# EasyEDA Pro project ProPrj_主控驱动一体板_V01_2025-04-22.epro

# Schematic Schematic1
Board Name: Board1; Create Date: 2025-04-20; Page Name: P1; Project Name: 主控驱动一体板_V01; Schematic Name: Schematic1; Update Date: 2025-04-20; Company: 嘉立创EDA; Page Size: A4; Version: V1.0
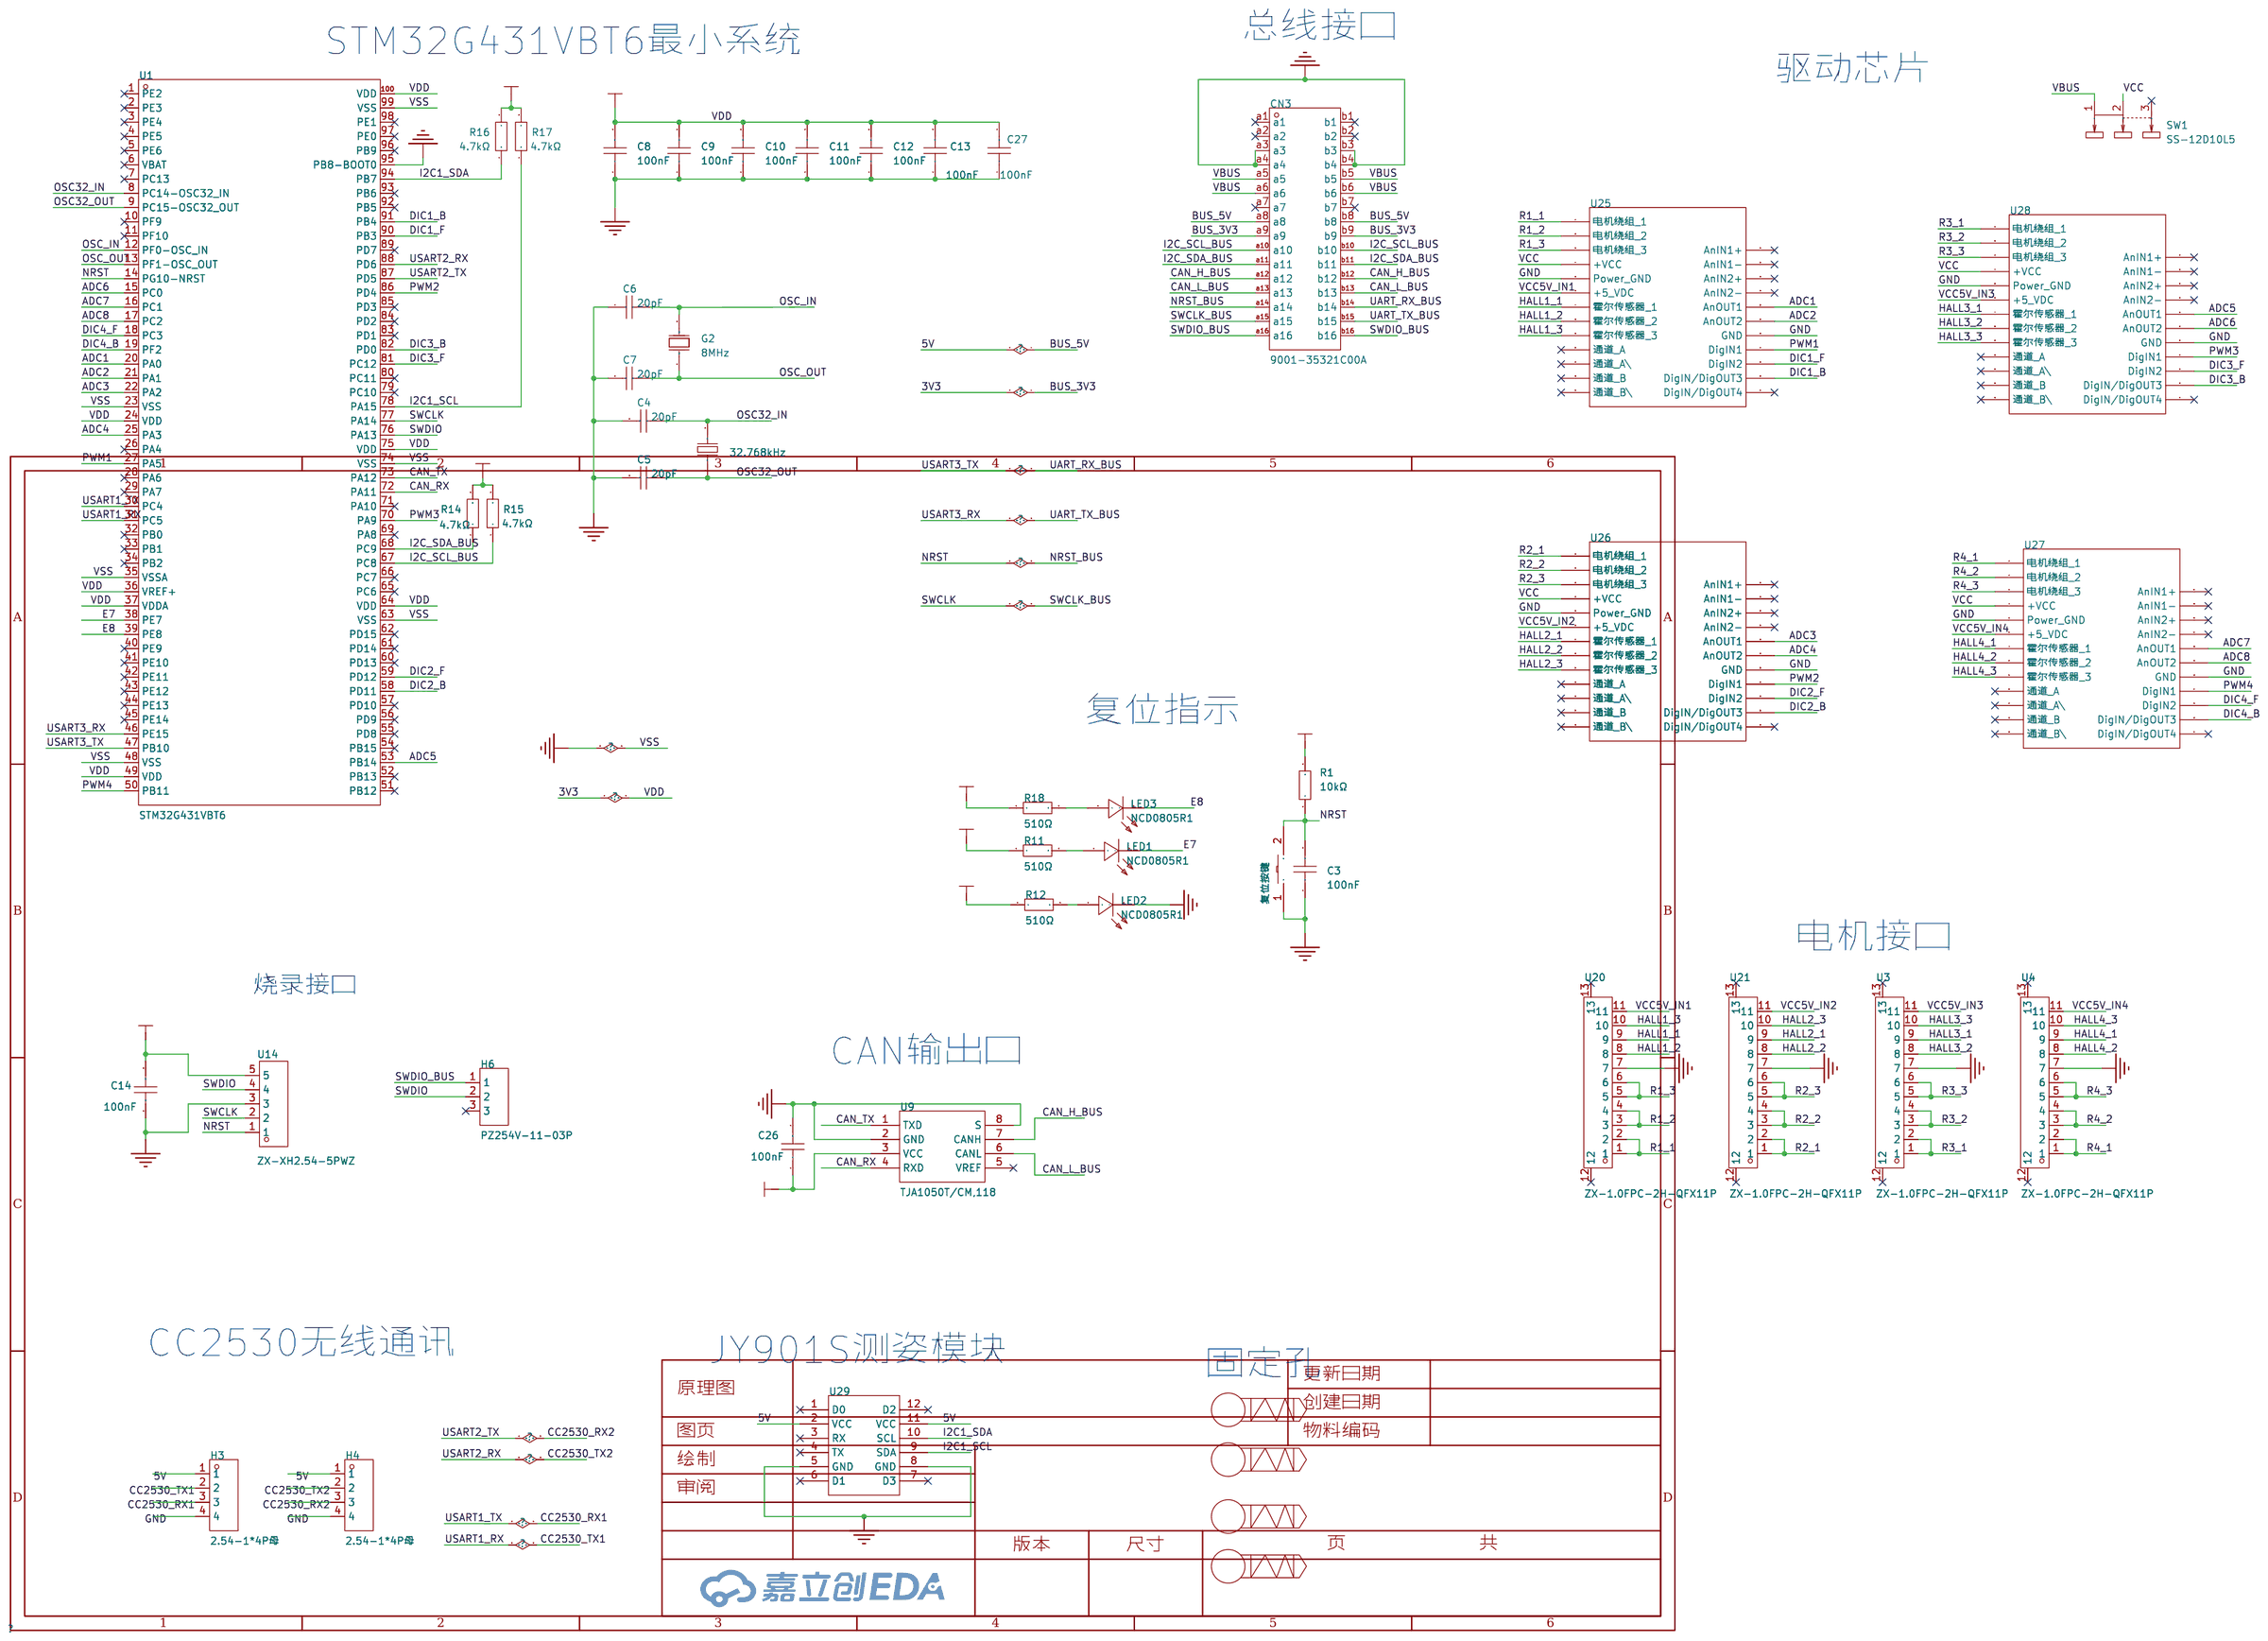
[diagram p0: schematic sheet]

## Parts
C3  100nF  [C0603]
C4  20pF  [C0603]
C5  20pF  [C0603]
C6  20pF  [C0603]
C7  20pF  [C0603]
C8  100nF  [C0603]
C9  100nF  [C0603]
C10  100nF  [C0603]
C11  100nF  [C0603]
C12  100nF  [C0603]
C13  100nF  [C0603]
C14  100nF  [C0603]
C26  100nF  [C0603]
C27  100nF  [C0603]
CN3  9001-35321C00A  [CONN-TH_32P-P2.54_9001-35321C00A]
G1  32.768kHz  [FC-135R_L3.2-W1.5]
G2  8MHz  [CRYSTAL-SMD_L5.0-W3.2]
H3  2.54-1*4P母  [DL-20]
H4  2.54-1*4P母  [DL-20]
H6  PZ254V-11-03P  [HDR-TH_3P-P2.54-V-M]
KEY1  复位按键  [SW-SMD_L6.0-W3.3-LS8.0]
LED1  NCD0805R1  [LED0805-R-RD]
LED2  NCD0805R1  [LED0805-R-RD]
LED3  NCD0805R1  [LED0805-R-RD]
R1  10kΩ  [R0603]
R11  510Ω  [R0603]
R12  510Ω  [R0603]
R14  4.7kΩ  [R0603]
R15  4.7kΩ  [R0603]
R16  4.7kΩ  [R0603]
R17  4.7kΩ  [R0603]
R18  510Ω  [R0603]
SW1  SS-12D10L5  [SW-TH_SS-12D10L5]
TP1  M3铜柱带丝印  [footprint_c5c0]
TP2  M3铜柱带丝印  [footprint_c5c0]
TP3  M3铜柱带丝印  [footprint_c5c0]
TP4  M3铜柱带丝印  [footprint_c5c0]
U1  STM32G431VBT6  [LQFP-100_L14.0-W14.0-P0.50-LS16.0-BL]
U3  ZX-1.0FPC-2H-QFX11P  [FPC-SMD_11P-P1.00_ZX-1.0FPC-2H-QFX11P]
U4  ZX-1.0FPC-2H-QFX11P  [FPC-SMD_11P-P1.00_ZX-1.0FPC-2H-QFX11P]
U9  TJA1050T/CM,118  [SOIC-8_L5.0-W4.0-P1.27-LS6.0-BL]
U14  ZX-XH2.54-5PWZ  [CONN-TH_ZX-XH2.54-5PWZ]
U20  ZX-1.0FPC-2H-QFX11P  [FPC-SMD_11P-P1.00_ZX-1.0FPC-2H-QFX11P]
U21  ZX-1.0FPC-2H-QFX11P  [FPC-SMD_11P-P1.00_ZX-1.0FPC-2H-QFX11P]
U25  -  [MAXON_2]
U26  -  [MAXON_2]
U27  -  [MAXON_2]
U28  -  [MAXON_2]
U29  -  [JY901S_无评估板]

## Library data of the parts
C3 C8-C14 C26 C27 = CC0603KRX7R9BB104: 容值:100nF;精度:±10%;额定电压:50V;材质(温度系数):X7R;; LCSC Part Name: 100nF ±10% 50V; Supplier Part: C14663; Manufacturer: YAGEO(国巨); Supplier Footprint: 0603; JLCPCB Part Class: 基础库; Datasheet: https://atta.szlcsc.com/upload/public/pdf/source/20180910/C282072_33301C7F631E79921B82A8DAC6BCC5B3.pdf; Supplier: LCSC; Tolerance: ±10%; Voltage Rated: 50V; Temperature Coefficient: X7R
C4-C7 = CL10C200JB8NNNC: 容值:20pF;精度:±5%;额定电压:50V;材质(温度系数):C0G;; LCSC Part Name: 20pF ±5% 50V; Supplier Part: C1648; Manufacturer: SAMSUNG(三星); Supplier Footprint: 0603; JLCPCB Part Class: Basic Part; Datasheet: https://atta.szlcsc.com/upload/public/pdf/source/20160218/1457707763339.pdf; Supplier: LCSC; Tolerance: ±5%; Voltage Rated: 50V; Temperature Coefficient: C0G
CN3 = 9001-35321C00A: Supplier Part: C5173389; Manufacturer: WingTAT(格林柏); Supplier Footprint: 弯插,P=2.54mm; JLCPCB Part Class: 扩展库; Datasheet: https://atta.szlcsc.com/upload/public/pdf/source/20220930/6F5D259D0E345A9F0D7DF594CFB3CC0F.pdf; Supplier: LCSC
G1 = Q13FC13500004_C32346: 晶振类型:贴片晶振;频率:32.768kHz;常温频差:±20ppm;外接负载电容:12.5pF;; LCSC Part Name: 32.768kHz ±20ppm 12.5pF; Supplier Part: C32346; Manufacturer: EPSON(爱普生); Manufacturer Part: Q13FC13500004; Supplier Footprint: SMD3215-2P; JLCPCB Part Class: 基础库; Datasheet: https://atta.szlcsc.com/upload/public/pdf/source/20240418/0E0FF5F0356BA3753F616001439D1416.pdf; Supplier: LCSC; Crystal Type: 贴片晶振; Normal temperature Frequency Tolerance: ±20ppm; External load capacitor: 12.5pF; Equivalent Series Resistance (ESR): 70kΩ; Operating Temperature: -40℃~+85℃
G2 = X50328MSB2GI: 晶振类型:贴片晶振;频率:8MHz;常温频差:±10ppm;外接负载电容:20pF;频率稳定度(全温):±20ppm;; LCSC Part Name: 8MHz ±10ppm 20pF YSX530GA; Supplier Part: C115962; Manufacturer: YXC(扬兴晶振); Supplier Footprint: SMD5032; JLCPCB Part Class: 基础库; Datasheet: https://atta.szlcsc.com/upload/public/pdf/source/20240329/44922B0AF7B60E58E9B66993B6077277.pdf; Supplier: LCSC; Crystal Type: 贴片晶振; Normal temperature Frequency Tolerance: ±10ppm; External load capacitor: 20pF; Frequency Stability(Full temperature range): ±20ppm; Operating Temperature: -40℃~+85℃
H3 H4 = 2.54-1*4P母: 插孔结构:1x4P;间距:2.54mm;行距:-;圆孔/方孔:方孔;安装类型:直插;排数:单排;总孔位数:4P;额定电流:3A;额定电压:-;插孔方向:顶部;塑高:-;触头材质:青铜;触头镀层:-;工作温度范围:-40℃~+105℃;焊接温度(最大值):-;; LCSC Part Name: 间距:2.54mm 1x4P 直插; Supplier Part: C2718488; Manufacturer: BOOMELE(博穆精密); Supplier Footprint: 插件,P=2.54mm; JLCPCB Part Class: 扩展库; Datasheet: https://atta.szlcsc.com/upload/public/pdf/source/20210301/C2718488_F4427B881E42CAA8DDB0B1C12B3A522C.pdf; Supplier: LCSC; Holes Structure: 1x4P; Pitch: 2.54mm; Circular Hole / Square Hole: 方孔; Mounting Type: 直插; Number of Rows: 单排; Number of Holes: 4P; Current Rating (Max): 3A; Holes Direction: 顶部; Contact Material: 青铜; Operating Temperature Range: -40℃~+105℃
H6 = PZ254V-11-03P: 插针结构:1x3P;间距:2.54mm;行距:-;圆针/方针:方针;安装方式:直插;排数:单排;总PIN位数:3P;额定电流:3A;额定电压:250V;配合针长度:6mm;塑高:2.5mm;端接针长度:3mm;工作温度:-40℃~+105℃;颜色:黑色;; LCSC Part Name: 1x3P 间距:2.54mm 方针 直插; Supplier Part: C2937625; Manufacturer: XFCN(兴飞); Supplier Footprint: 插件,P=2.54mm; JLCPCB Part Class: 扩展库; Datasheet: https://atta.szlcsc.com/upload/public/pdf/source/20200309/C492402_8335C3D49C4E4C618838D59BB1D024C1.pdf; Supplier: LCSC; Pin Structure: 1x3P; Pitch: 2.54mm; Circluar Pins/Square Pins: 方针; Mounting Type: 直插; Number of Rows: 单排; Number of Pins: 3P; Current Rating: 3A; Voltage Rating (Max): 250V; Length of Mating Pin: 6mm; Insulation Height: 2.5mm; Length of End Connection Pin: 3mm; Operating Temperature: -40℃~+105℃; Color: 黑色
KEY1 = TS-1101-C-W: 电路结构:单刀单掷;按钮形状:矩形按钮;作用力:260gf;安装方式:立贴;开关长度:6mm;开关宽度:3.6mm;开关高度:2.5mm;带支架:不带;触点电流:50mA;额定电压(AC):-;额定电压(DC):12V;额定功率:-;绝缘电阻:-;带灯:无;机械寿命:5万次;; LCSC Part Name: 6*3.6*2.5mm 立贴 轻触开关; Supplier Part: C318938; Manufacturer: XKB Connectivity(中国星坤); Supplier Footprint: SMD; JLCPCB Part Class: Extended Part; Datasheet: https://atta.szlcsc.com/upload/public/pdf/source/20200227/C318938_C2E53B1EEDE37D980A33616AC086DE53.pdf; Supplier: LCSC; Circuit: 单刀单掷; Actuator Style: 矩形按钮; Operating Force: 260gf; Mounting Style: 立贴; Switch Length: 6mm; Switch Width: 3.6mm; Switch Height: 2.5mm; Strike Gundam: 不带; Contact Current: 50mA; Voltage Rating (DC): 12V; Actuator/Cap Color: 白色带淡绿; With Lamp: 无; Mechanical Life: 5万次; Operating Temperature: -30℃~+85℃
LED1-LED3 = NCD0805R1: 灯头类型:-;发光颜色:红色;正向电压(VF):1.6V~2.6V;功率:65mW;正向电流:20mA;主波长:615nm~630nm;二极管配置:独立二极管;透镜颜色:无色透明透镜;色温:-;发光强度:67mcd~195mcd;发光角度:130°;载带方式:-;工作温度:-30℃~+85℃;; Supplier Part: C84256; Manufacturer: 国星光电; Supplier Footprint: 0805; JLCPCB Part Class: 基础库; Datasheet: https://atta.szlcsc.com/upload/public/pdf/source/20200820/C84256_F0A75A43B3EAD75808600A0514C76B99.pdf; Supplier: LCSC; Emitted Color: 红色; Forward Voltage (VF): 1.6V~2.6V; Power Dissipation: 65mW; Forward Current: 20mA; Dominant Wavelength: 615nm~630nm; Diode Configuration: 独立二极管; Lens Color: 无色透明透镜; Luminous Intensity: 67mcd~195mcd; Viewing Angle: 130°; Operating Temperature: -30℃~+85℃
R1 = 0603WAF1002T5E: 电阻类型:厚膜电阻;阻值:10kΩ;精度:±1%;功率:100mW;最大工作电压:75V;温度系数:±100ppm/℃;; LCSC Part Name: 厚膜电阻 10kΩ ±1% 100mW; Supplier Part: C25804; Manufacturer: UNI-ROYAL(厚声); Supplier Footprint: 0603; JLCPCB Part Class: 基础库; Datasheet: https://atta.szlcsc.com/upload/public/pdf/source/20200306/C422600_1E6D84923E4A46A82E41ADD87F860B5C.pdf; Supplier: LCSC; Type: 厚膜电阻; Tolerance: ±1%; Power(Watts): 100mW; Overload Voltage (Max): 75V; Temperature Coefficient: ±100ppm/℃; Operating Temperature Range: -55℃~+155℃
R11 R12 R18 = 0603WAF5100T5E: 电阻类型:厚膜电阻;阻值:510Ω;精度:±1%;功率:100mW;最大工作电压:75V;温度系数:±100ppm/℃;; LCSC Part Name: 510Ω ±1% 100mW 厚膜电阻; Supplier Part: C23193; Manufacturer: UNI-ROYAL(厚声); Supplier Footprint: 0603; JLCPCB Part Class: Basic Part; Datasheet: https://atta.szlcsc.com/upload/public/pdf/source/20200306/C422600_1E6D84923E4A46A82E41ADD87F860B5C.pdf; Supplier: LCSC; Type: 厚膜电阻; Tolerance: ±1%; Power(Watts): 100mW; Overload Voltage (Max): 75V; Temperature Coefficient: ±100ppm/℃; Operating Temperature Range: -55℃~+155℃
R14-R17 = 0603WAF4701T5E: 电阻类型:厚膜电阻;阻值:4.7kΩ;精度:±1%;功率:100mW;最大工作电压:75V;温度系数:±100ppm/℃;; LCSC Part Name: 4.7kΩ ±1% 100mW 厚膜电阻; Supplier Part: C23162; Manufacturer: UNI-ROYAL(厚声); Supplier Footprint: 0603; JLCPCB Part Class: Basic Part; Datasheet: https://atta.szlcsc.com/upload/public/pdf/source/20200306/C422600_1E6D84923E4A46A82E41ADD87F860B5C.pdf; Supplier: LCSC; Type: 厚膜电阻; Tolerance: ±1%; Power(Watts): 100mW; Overload Voltage (Max): 75V; Temperature Coefficient: ±100ppm/℃; Operating Temperature Range: -55℃~+155℃
SW1 = SS-12D10L5: 电路结构:单刀双掷;安装方式:直插;开关颜色:黑色;额定电流(DC):3A;额定电压(DC):125V;额定电流(AC):3A;额定电压(AC):125V;机械寿命:1万次;; LCSC Part Name: 柄长5mm 直插双档 滑动开关; Supplier Part: C319012; Manufacturer: XKB Connectivity(中国星坤); Supplier Footprint: 插件; Datasheet: https://atta.szlcsc.com/upload/public/pdf/source/20211009/D6412F37AABE6F9459A6EE7FA4DAEADB.pdf; Supplier: LCSC; Circuit: 单刀双掷; Actuator Style: 矩形柱状; Pin Style: PC引脚; Switch Length: 13mm; Switch Width: 6.8mm; Switch Height: 6.4mm; Mounting Style: 直插; Actuator Color: 黑色; Current Rating (DC): 3A; Voltage Rating (DC): 125V; Current Rating (AC): 3A; Voltage Rating (AC): 125V; Mechanical Life: 1万次; Operating Temperature: -40℃~+85℃
TP1-TP4 = M3铜柱带丝印
U1 = STM32G431VBT6: CPU内核:-;程序存储容量:128KB;RAM总容量:32KB;GPIO端口数量:86;工作电压范围:1.71V~3.6V;CPU最大主频:170MHz;程序存储器类型:FLASH;; LCSC Part Name: 带DSP和FPU的170MHz主流ARM Cortex-M4 MCU，具有128 KB Flash存储器、数学加速器和中等模拟电平集成; Supplier Part: C529359; Manufacturer: ST(意法半导体); Supplier Footprint: LQFP-100(14x14); JLCPCB Part Class: 扩展库; Datasheet: https://atta.szlcsc.com/upload/public/pdf/source/20200511/C529354_7C66CF00837B904D0C15DCE45B69418C.pdf; Supplier: LCSC; Program Storage Size: 128KB; RAM Size: 32KB; GPIO Ports Number: 86; Operating Voltage Range: 1.71V~3.6V; CPU Maximum Speed: 170MHz; Program Memory Type: FLASH; Operating Temperature Range: -40℃~+85℃; ADC (Bit): 12bit; DAC (Bit): 12bit; Peripheral/Function: PWM；PWM; Watchdog: 有; Infrared Data Association: 有; Low-Voltage Detect: 有; Direct Memory Access: 有; Internal Oscillator: 有
U3 U4 U20 U21 = ZX-1.0FPC-2H-QFX11P: 锁定特性:翻盖式;触点类型:下接;触点数量:11P;间距:1mm;安装类型:卧贴;工作温度范围:-25℃~+85℃;焊接温度(最大值):260℃;; LCSC Part Name: 间距:1mm P数:11P 翻盖式 下接; Supplier Part: C19191202; Manufacturer: Megastar(兆星); Supplier Footprint: SMD,P=1mm,卧贴; JLCPCB Part Class: Extended Part; Datasheet: https://atta.szlcsc.com/upload/public/pdf/source/20231122/256292DD8C1524577493EC69AD155F66.pdf; Supplier: LCSC; Locking Feature: 翻盖式; Contact Type: 下接; Number of Contacts: 11P; Pitch: 1mm; Mounting Type: 卧贴; FFC, FCB Thickness: 0.3mm; Height Above Board: 2mm; Contact Material: 铜合金; Contact Plating: 锡; Operating Temperature Range: -25℃~+85℃; Soldering Temperature(Max): 260℃
U9 = TJA1050T/CM,118: 类型:收发器;; LCSC Part Name: 4.75V~5.25V; Supplier Part: C6952; Manufacturer: NXP(恩智浦); Supplier Footprint: SOP-8; JLCPCB Part Class: 扩展库; Datasheet: https://atta.szlcsc.com/upload/public/pdf/source/20140411/1457707042917.pdf; Supplier: LCSC; Type: 收发器; Supply Voltage: 4.75V~5.25V; Supply Current: 50mA
U14 = ZX-XH2.54-5PWZ: 插针结构:1x5P;间距:2.54mm;安装方式:弯插;参考系列:XH;总PIN数:5P;排数:1;每排PIN数:5;行距:-;额定电流:3A;触头材质:黄铜;触头镀层:锡;工作温度范围:-25℃~+85℃;; Supplier Part: C7429644; Manufacturer: Megastar(兆星); Supplier Footprint: 弯插,P=2.54mm; JLCPCB Part Class: 扩展库; Datasheet: https://atta.szlcsc.com/upload/public/pdf/source/20230619/D9E5E4222EDAC56B190563A646F17377.pdf; Supplier: LCSC; Pins Structure: 1x5P; Pitch: 2.54mm; Mounting Style: 弯插; Reference Series: XH; Number of Pins: 5P; Number of Rows: 1; Number of PINs Per Row: 5; Current Rating (Max): 3A; Contact Material: 黄铜; Contact Plating: 锡; Operating Temperature Range: -25℃~+85℃
U25-U28 = MAXON2
U29 = JY901S_无评估板

## Nets
3V3: C8.2 C9.2 C10.2 C11.2 C12.2 C13.2 C14.2 C27.2 CN3.a9 CN3.b9 R1.2 R11.1 R12.1 R14.2 R15.2 R16.2 R17.2 R18.1 U1.24(VDD) U1.36(VREF+) U1.37(VDDA) U1.49(VDD) U1.64(VDD) U1.75(VDD) U1.100(VDD) U14.5
5V: C26.1 CN3.a8 CN3.b8 H3.1 H4.1 U9.3(VCC) U29.2(VCC) U29.11(VCC)
GND: C3.1 C4.2 C5.2 C6.2 C7.2 C8.1 C9.1 C10.1 C11.1 C12.1 C13.1 C14.1 C26.2 C27.1 CN3.a3 CN3.a4 CN3.b3 CN3.b4 H3.4 H4.4 KEY1.1 LED2.2(-) U1.23(VSS) U1.35(VSSA) U1.48(VSS) U1.63(VSS) U1.74(VSS) U1.95(PB8-BOOT0) U1.99(VSS) U3.7 U4.7 U9.2(GND) U9.8(S) U14.3 U20.7 U21.7 U25.5(Power_GND) U25.18(GND) U26.5(Power_GND) U26.18(GND) U27.5(Power_GND) U27.18(GND) U28.5(Power_GND) U28.18(GND) U29.5(GND) U29.8(GND)
VBUS: CN3.a5 CN3.a6 CN3.b5 CN3.b6 SW1.1
VCC: SW1.2 U25.4(+VCC) U26.4(+VCC) U27.4(+VCC) U28.4(+VCC)
VCC5V_IN1: U20.11 U25.6(+5 VDC)
VCC5V_IN2: U21.11 U26.6(+5 VDC)
VCC5V_IN3: U3.11 U28.6(+5 VDC)
VCC5V_IN4: U4.11 U27.6(+5 VDC)
ADC1: U1.20(PA0) U25.20(AnOUT1)
ADC2: U1.21(PA1) U25.19(AnOUT2)
ADC3: U1.22(PA2) U26.20(AnOUT1)
ADC4: U1.25(PA3) U26.19(AnOUT2)
ADC5: U1.53(PB14) U28.20(AnOUT1)
ADC6: U1.15(PC0) U28.19(AnOUT2)
ADC7: U1.16(PC1) U27.20(AnOUT1)
ADC8: U1.17(PC2) U27.19(AnOUT2)
CAN_H_BUS: CN3.a12 CN3.b12 U9.7(CANH)
CAN_L_BUS: CN3.a13 CN3.b13 U9.6(CANL)
CAN_RX: U1.72(PA11) U9.4(RXD)
CAN_TX: U1.73(PA12) U9.1(TXD)
CC2530_RX1: H3.3 U1.30(PC4)
CC2530_RX2: H4.3 U1.87(PD5)
CC2530_TX1: H3.2 U1.31(PC5)
CC2530_TX2: H4.2 U1.88(PD6)
DIC1_B: U1.91(PB4) U25.15(DigIN/DigOUT3)
DIC1_F: U1.90(PB3) U25.16(DigIN2)
DIC2_B: U1.58(PD11) U26.15(DigIN/DigOUT3)
DIC2_F: U1.59(PD12) U26.16(DigIN2)
DIC3_B: U1.82(PD0) U28.15(DigIN/DigOUT3)
DIC3_F: U1.81(PC12) U28.16(DigIN2)
DIC4_B: U1.19(PF2) U27.15(DigIN/DigOUT3)
DIC4_F: U1.18(PC3) U27.16(DigIN2)
E7: LED1.2(-) U1.38(PE7)
E8: LED3.2(-) U1.39(PE8)
HALL1_1: U20.9 U25.7(霍尔传感器 1)
HALL1_2: U20.8 U25.8(霍尔传感器 2)
HALL1_3: U20.10 U25.9(霍尔传感器 3)
HALL2_1: U21.9 U26.7(霍尔传感器 1)
HALL2_2: U21.8 U26.8(霍尔传感器 2)
HALL2_3: U21.10 U26.9(霍尔传感器 3)
HALL3_1: U3.9 U28.7(霍尔传感器 1)
HALL3_2: U3.8 U28.8(霍尔传感器 2)
HALL3_3: U3.10 U28.9(霍尔传感器 3)
HALL4_1: U4.9 U27.7(霍尔传感器 1)
HALL4_2: U4.8 U27.8(霍尔传感器 2)
HALL4_3: U4.10 U27.9(霍尔传感器 3)
I2C1_SCL: R17.1 U1.78(PA15) U29.9(SDA)
I2C1_SDA: R16.1 U1.94(PB7) U29.10(SCL)
I2C_SCL_BUS: CN3.a10 CN3.b10 R15.1 U1.67(PC8)
I2C_SDA_BUS: CN3.a11 CN3.b11 R14.1 U1.68(PC9)
NRST: C3.2 CN3.a14 KEY1.2 R1.1 U1.14(PG10-NRST) U14.1
OSC32_IN: C4.1 G1.2 U1.8(PC14-OSC32_IN)
OSC32_OUT: C5.1 G1.1 U1.9(PC15-OSC32_OUT)
OSC_IN: C6.1 U1.12(PF0-OSC_IN)
OSC_OUT: C7.1 G2.1(OSC1) U1.13(PF1-OSC_OUT)
PWM1: U1.27(PA5) U25.17(DigIN1)
PWM2: U1.86(PD4) U26.17(DigIN1)
PWM3: U1.70(PA9) U28.17(DigIN1)
PWM4: U1.50(PB11) U27.17(DigIN1)
R1_1: U20.1 U20.2 U25.1(电机绕组 1)
R1_2: U20.3 U20.4 U25.2(电机绕组 2)
R1_3: U20.5 U20.6 U25.3(电机绕组 3)
R2_1: U21.1 U21.2 U26.1(电机绕组 1)
R2_2: U21.3 U21.4 U26.2(电机绕组 2)
R2_3: U21.5 U21.6 U26.3(电机绕组 3)
R3_1: U3.1 U3.2 U28.1(电机绕组 1)
R3_2: U3.3 U3.4 U28.2(电机绕组 2)
R3_3: U3.5 U3.6 U28.3(电机绕组 3)
R4_1: U4.1 U4.2 U27.1(电机绕组 1)
R4_2: U4.3 U4.4 U27.2(电机绕组 2)
R4_3: U4.5 U4.6 U27.3(电机绕组 3)
SWCLK: CN3.a15 U1.77(PA14) U14.2
SWDIO: H6.2 U1.76(PA13) U14.4
SWDIO_BUS: CN3.a16 CN3.b16 H6.1
UART_RX_BUS: CN3.b14 U1.47(PB10)
UART_TX_BUS: CN3.b15 U1.46(PE15)
$1N3007: LED2.1(+) R12.2
$1N3059: LED1.1(+) R11.2
$1N7223: LED3.1(+) R18.2

Not connected (* = marked no-connect by the designer): CN3 a1* a2* a7* b1* b2* b7*; G2 2(OSC2); H6 3*; SW1 3*; U1 1(PE2)* 2(PE3)* 3(PE4)* 4(PE5)* 5(PE6)* 6(VBAT)* 7(PC13)* 10(PF9)* 11(PF10)* 26(PA4)* 28(PA6)* 29(PA7)* 32(PB0)* 33(PB1)* 34(PB2)* 40(PE9)* 41(PE10)* 42(PE11)* 43(PE12)* 44(PE13)* 45(PE14)* 51(PB12)* 52(PB13)* 54(PB15)* 55(PD8)* 56(PD9)* 57(PD10)* 60(PD13)* 61(PD14)* 62(PD15)* 65(PC6)* 66(PC7)* 69(PA8)* 71(PA10)* 79(PC10)* 80(PC11)* 83(PD1)* 84(PD2)* 85(PD3)* 89(PD7)* 92(PB5)* 93(PB6)* 96(PB9)* 97(PE0)* 98(PE1)*; U3 12* 13*; U4 12* 13*; U9 5(VREF)*; U20 12* 13*; U21 12* 13*; U25 10(通道 A)* 11(通道 A\)* 12(通道 B)* 13(通道 B\)* 14(DigIN/DigOUT4)* 21(AnIN2−)* 22(AnIN2+)* 23(AnIN1−)* 24(AnIN1+)*; U26 10(通道 A)* 11(通道 A\)* 12(通道 B)* 13(通道 B\)* 14(DigIN/DigOUT4)* 21(AnIN2−)* 22(AnIN2+)* 23(AnIN1−)* 24(AnIN1+)*; U27 10(通道 A)* 11(通道 A\)* 12(通道 B)* 13(通道 B\)* 14(DigIN/DigOUT4)* 21(AnIN2−)* 22(AnIN2+)* 23(AnIN1−)* 24(AnIN1+)*; U28 10(通道 A)* 11(通道 A\)* 12(通道 B)* 13(通道 B\)* 14(DigIN/DigOUT4)* 21(AnIN2−)* 22(AnIN2+)* 23(AnIN1−)* 24(AnIN1+)*; U29 1(D0)* 3(RX)* 4(TX)* 6(D1)* 7(D3)* 12(D2)*

## Notes on the sheet
- 总线接口
- STM32G431VBT6最小系统
- 驱动芯片
- 复位指示
- 电机接口
- 烧录接口
- CAN输出口
- CC2530无线通讯
- JY901S测姿模块
- 固定孔

# Board PCB1
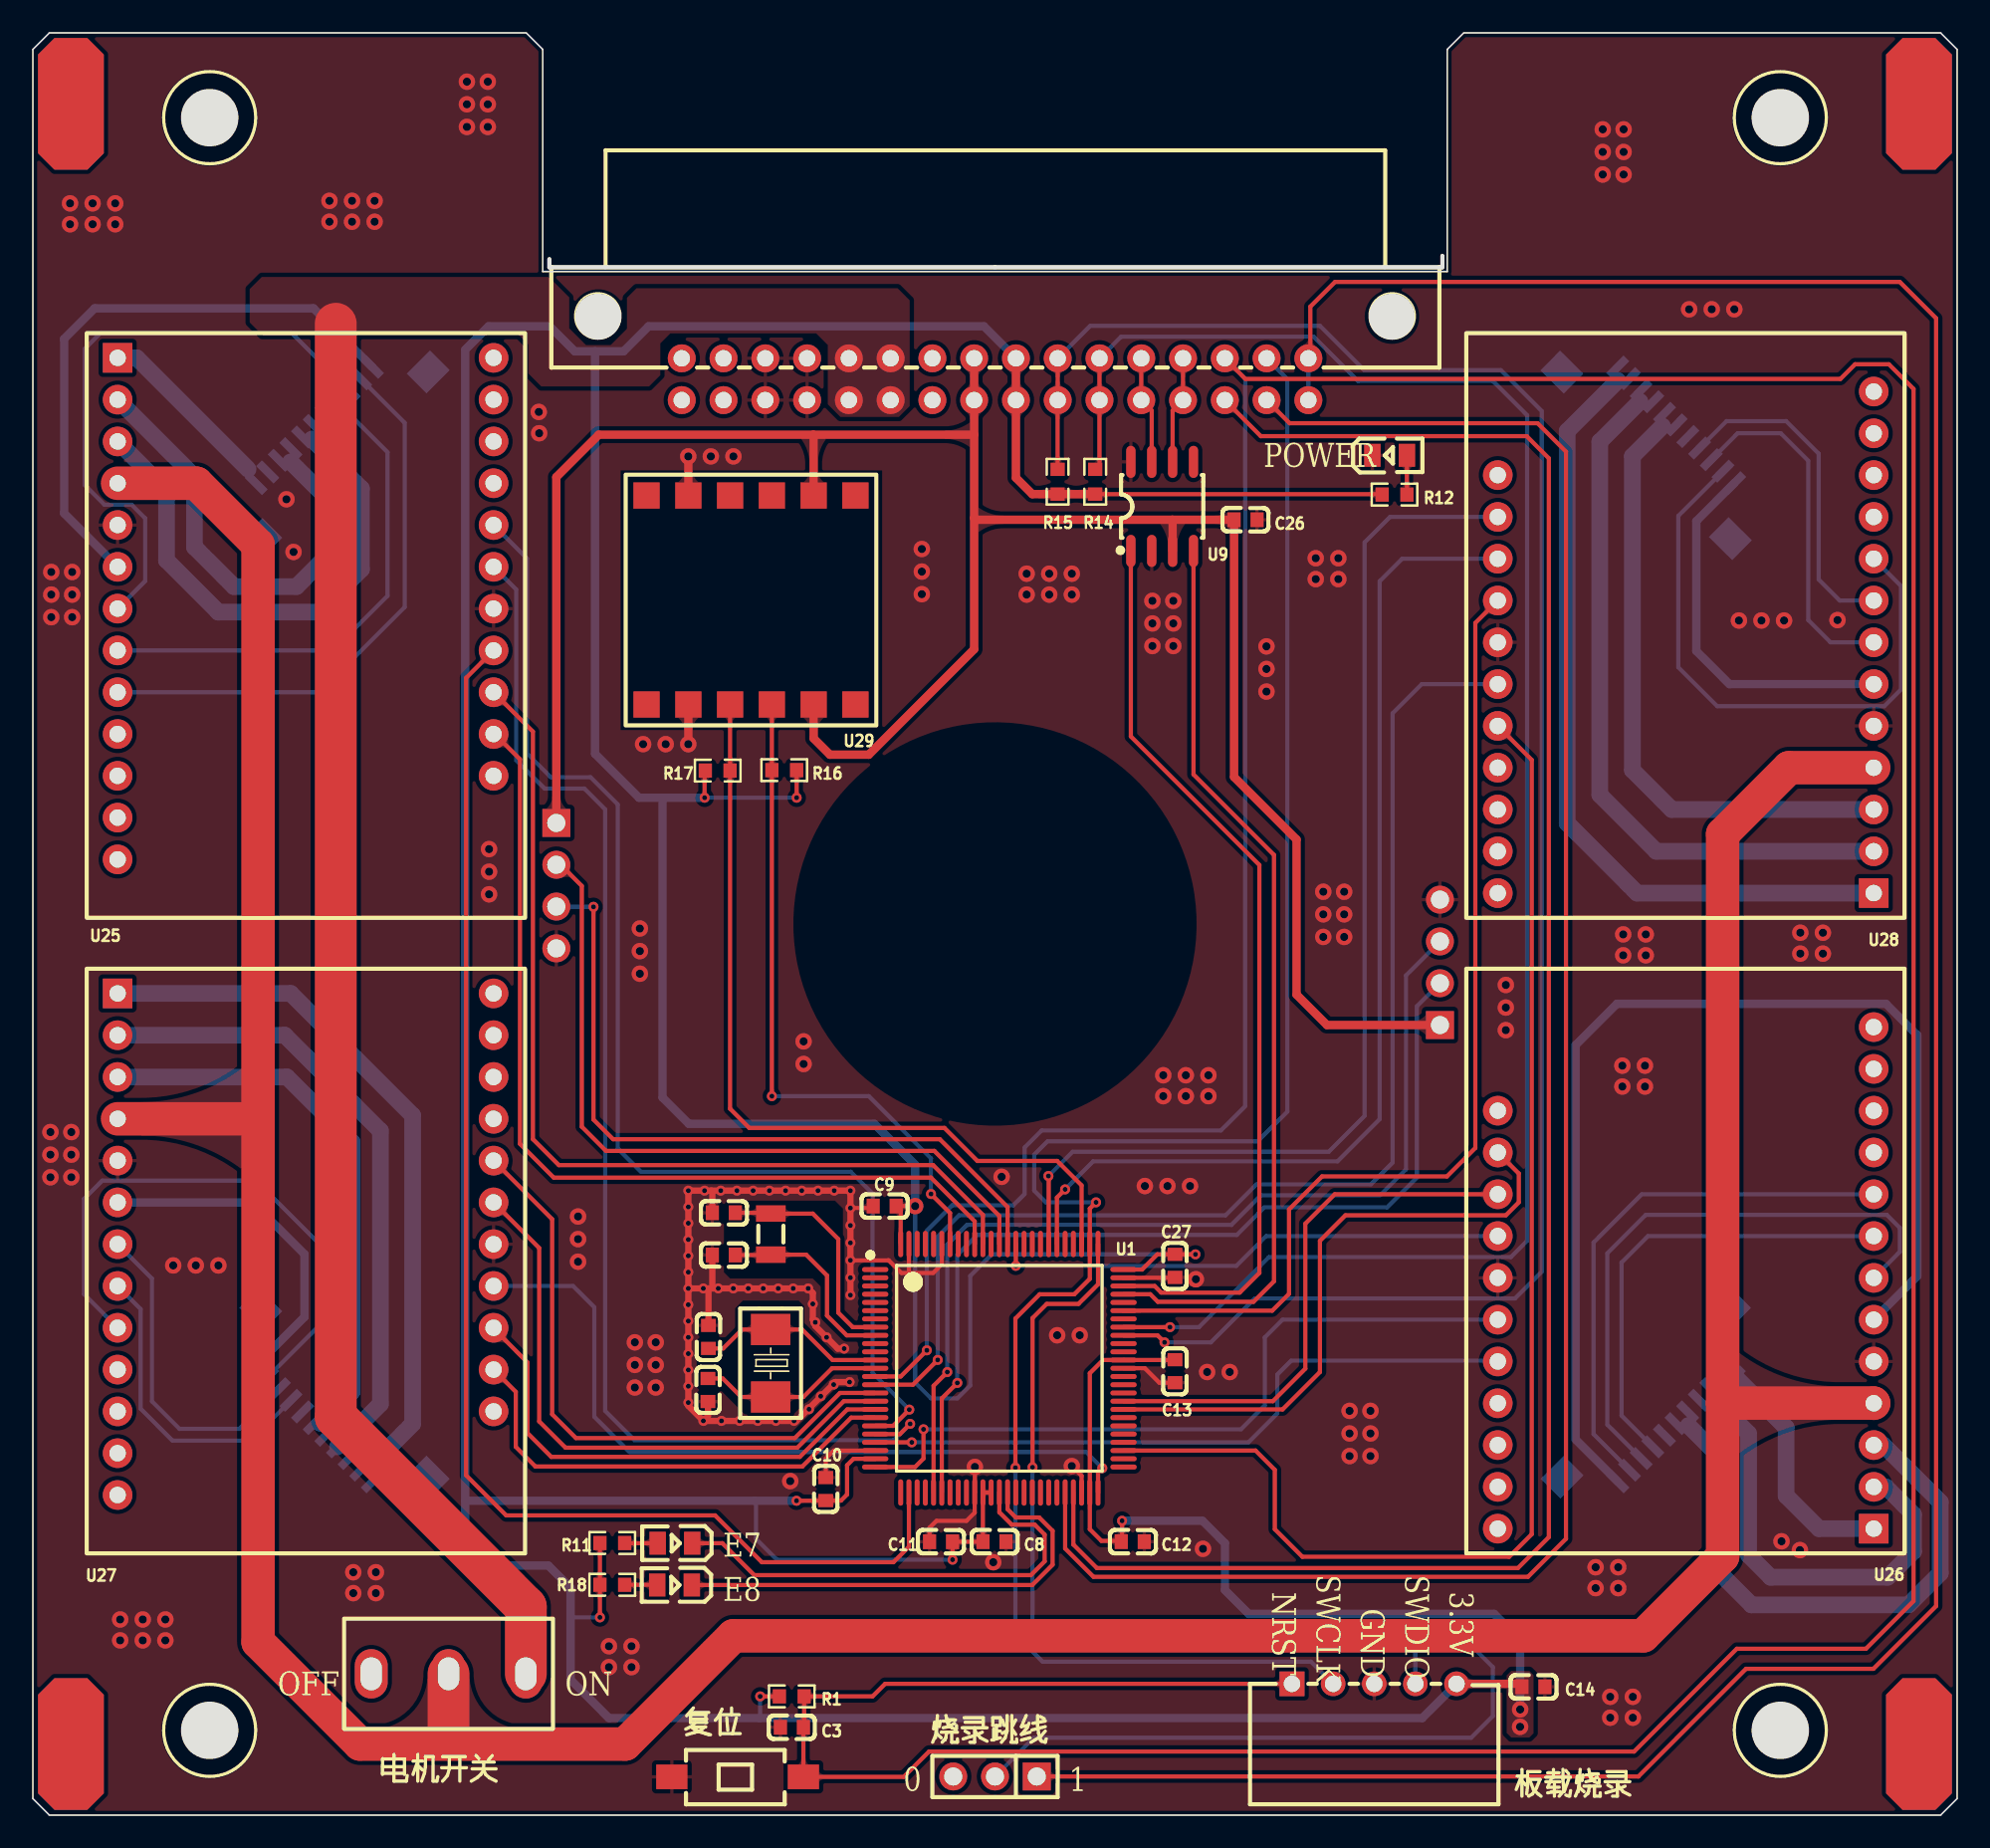
[diagram p1: board, top side]
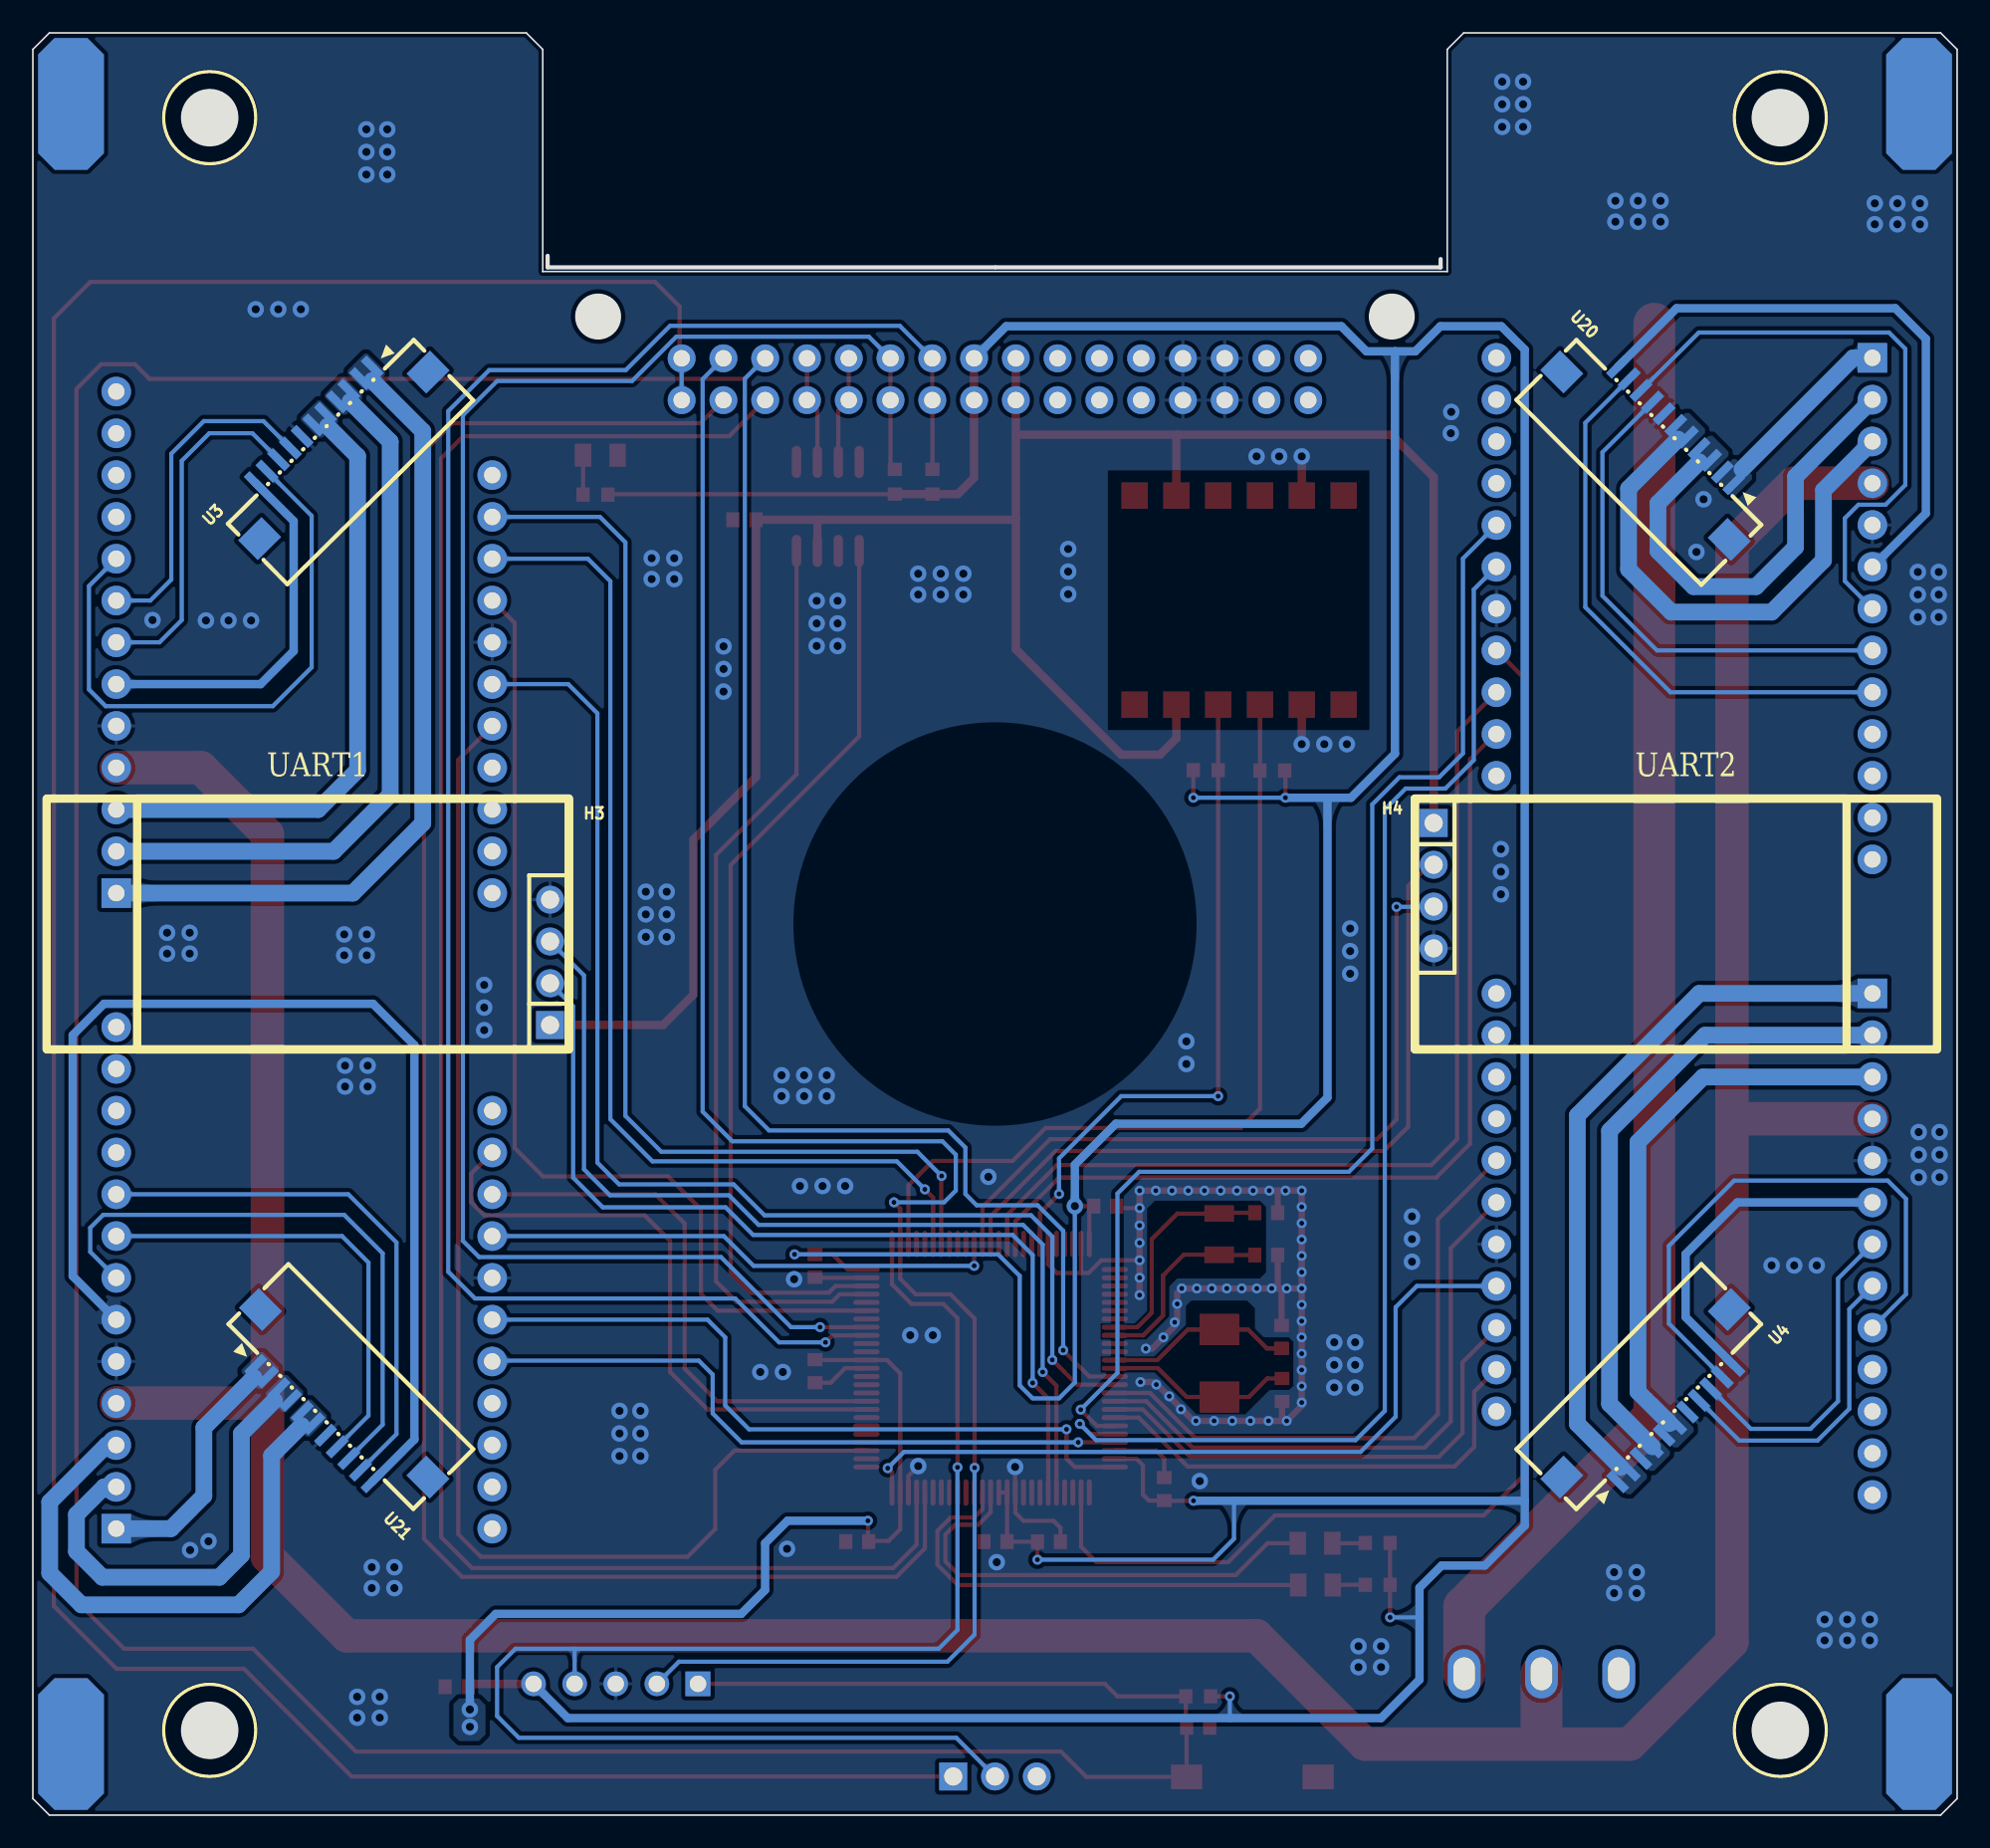
[diagram p2: board, bottom side, seen from below]

Outline 117 x 108.3 mm; copper layers: Top Layer, Bottom Layer. Coordinates in mm from the lower left corner of the outline.
Outline path: 0,1 0,107.3 1,108.3 30,108.3 31,107.3 31,93.8 86,93.8 86,107.3 87,108.3 116,108.3 117,107.3 117,1 116,0 1,0 0,1
Stack: Top Layer 0.035mm / Dielectric1 1.51mm FR4 er 4.5 / Bottom Layer 0.035mm

## Design rules (mm)
net OSC_IN: DP2
net OSC_OUT: DP2
net CAN_H_BUS: DP1
net CAN_L_BUS: DP1
template: 自定义配置
spacing copperThickness1oz (default): track to track 0.102, other pairs 0.152 to 0.3
spacing copperThickness2oz: track to track 0.203, other pairs 0.152 to 0.3
track width copperThickness1oz (default): min 0.127, default 0.254, max 2.54
track width copperThickness2oz: min 0.203, default 0.254, max 2.54
differential pair differentialPair (default): width min 0.127, default 0.254, max 2.54; gap min 0.152, default 0.152
via viaSize (default): diameter min 0.5, default 0.61, max 10; hole min 0.3, default 0.305, max 6.299

## Placement (name value [footprint] x y rotation side)
C3  100nF  [C0603]  46.15 5.33 0 top
C4  20pF  [C0603]  42.01 36.6 180 top
C5  20pF  [C0603]  42.01 34.04 180 top
C6  20pF  [C0603]  41.08 29.06 90 top
C7  20pF  [C0603]  41.05 25.83 270 top
C8  100nF  [C0603]  58.47 16.62 180 top
C9  100nF  [C0603]  51.79 37.01 0 top
C10  100nF  [C0603]  48.21 19.81 270 top
C11  100nF  [C0603]  55.22 16.61 0 top
C12  100nF  [C0603]  66.88 16.62 180 top
C13  100nF  [C0603]  69.44 26.97 90 top
C14  100nF  [C0603]  91.24 7.8 180 top
C26  100nF  [C0603]  73.74 78.71 0 top
C27  100nF  [C0603]  69.44 33.38 90 top
CN3  9001-35321C00A  [CONN-TH_32P-P2.54_9001-35321C00A]  58.5 87.25 180 top
G1  32.768kHz  [FC-135R_L3.2-W1.5]  44.87 35.31 90 top
G2  8MHz  [CRYSTAL-SMD_L5.0-W3.2]  44.86 27.46 90 top
H3  2.54-1*4P母  [DL-20]  85.55 47.88 90 bottom
H4  2.54-1*4P母  [DL-20]  31.83 60.42 270 bottom
H6  PZ254V-11-03P  [HDR-TH_3P-P2.54-V-M]  58.5 2.35 180 top
KEY1  复位按键  [SW-SMD_L6.0-W3.3-LS8.0]  42.85 2.32 0 top
LED1  NCD0805R1  [LED0805-R-RD]  39.04 16.52 180 top
LED2  NCD0805R1  [LED0805-R-RD]  82.5 82.63 0 top
LED3  NCD0805R1  [LED0805-R-RD]  39.01 13.98 180 top
NOREF  -  [Pad_ie3690]  114.68 103.99 0 top
NOREF#2  -  [Pad_ie3689]  114.68 4.32 0 top
NOREF#3  -  [Pad_ie3691]  2.31 103.99 0 top
NOREF#4  -  [Pad_ie3645]  2.31 4.32 0 top
R1  10kΩ  [R0603]  46.14 7.21 180 top
R11  510Ω  [R0603]  35.23 16.53 0 top
R12  510Ω  [R0603]  82.79 80.24 0 top
R14  4.7kΩ  [R0603]  64.59 81.03 270 top
R15  4.7kΩ  [R0603]  62.31 81.03 270 top
R16  4.7kΩ  [R0603]  45.69 63.5 0 top
R17  4.7kΩ  [R0603]  41.64 63.47 180 top
R18  510Ω  [R0603]  35.23 13.99 0 top
SW1  SS-12D10L5  [SW-TH_SS-12D10L5]  25.27 8.59 180 top
TP1  M3铜柱带丝印  [footprint_c5c0]  10.75 5.15 0 top
TP2  M3铜柱带丝印  [footprint_c5c0]  10.75 103.15 0 top
TP3  M3铜柱带丝印  [footprint_c5c0]  106.25 103.15 0 top
TP4  M3铜柱带丝印  [footprint_c5c0]  106.25 5.15 0 top
U1  STM32G431VBT6  [LQFP-100_L14.0-W14.0-P0.50-LS16.0-BL]  58.77 27.15 270 top
U3  ZX-1.0FPC-2H-QFX11P  [FPC-SMD_11P-P1.00_ZX-1.0FPC-2H-QFX11P]  99 83.55 135.3 bottom
U4  ZX-1.0FPC-2H-QFX11P  [FPC-SMD_11P-P1.00_ZX-1.0FPC-2H-QFX11P]  18.03 24.71 315 bottom
U9  TJA1050T/CM,118  [SOIC-8_L5.0-W4.0-P1.27-LS6.0-BL]  68.66 79.53 0 top
U14  ZX-XH2.54-5PWZ  [CONN-TH_ZX-XH2.54-5PWZ]  81.56 7.98 0 top
U20  ZX-1.0FPC-2H-QFX11P  [FPC-SMD_11P-P1.00_ZX-1.0FPC-2H-QFX11P]  18.03 83.53 225 bottom
U21  ZX-1.0FPC-2H-QFX11P  [FPC-SMD_11P-P1.00_ZX-1.0FPC-2H-QFX11P]  98.99 24.71 45 bottom
U25  -  [MAXON_2]  5.15 88.55 90 top
U26  -  [MAXON_2]  111.93 17.41 270 top
U27  -  [MAXON_2]  5.15 49.93 90 top
U28  -  [MAXON_2]  111.93 56.03 270 top
U29  -  [JY901S_无评估板]  51.28 81.46 270 top

## Footprints (pads in the part's own frame, mm; a bottom-side part is the same pattern mirrored in y, then rotated)
C0603
  rect 0.8x0.9 smd: 1(-0.7,0) 2(0.7,0)
CONN-TH_32P-P2.54_9001-35321C00A
  round 1.7 hole 1: a1(19.05,-1.27) a2(16.51,-1.27) a3(13.97,-1.27) a4(11.43,-1.27) a5(8.89,-1.27) a6(6.35,-1.27) a7(3.81,-1.27) a8(1.27,-1.27) a9(-1.27,-1.27) a10(-3.81,-1.27) a11(-6.35,-1.27) a12(-8.89,-1.27) a13(-11.43,-1.27) a14(-13.97,-1.27) a15(-16.51,-1.27) a16(-19.05,-1.27) b1(19.05,1.27) b2(16.51,1.27) b3(13.97,1.27) b4(11.43,1.27) b5(8.89,1.27) b6(6.35,1.27) b7(3.81,1.27) b8(1.27,1.27) b9(-1.27,1.27) b10(-3.81,1.27) b11(-6.35,1.27) b12(-8.89,1.27) b13(-11.43,1.27) b14(-13.97,1.27) b15(-16.51,1.27) b16(-19.05,1.27)
CONN-TH_ZX-XH2.54-5PWZ
  rect 1.524x1.5 hole 1: 1(-5,0)
  round 1.5 hole 1: 2(-2.5,0) 3(0,0) 4(2.5,0) 5(5,0)
CRYSTAL-SMD_L5.0-W3.2
  rect 1.9x2.4 smd: 1(-2.05,0) 2(2.05,0)
DL-20
  rect 1.7x1.7 hole 1.1: 1(0.127,0)
  round 1.7 hole 1.1: 2(2.667,0) 3(5.207,0) 4(7.747,0)
FC-135R_L3.2-W1.5
  rect 1x1.8 smd: 1(-1.25,0) 2(1.25,0)
FPC-SMD_11P-P1.00_ZX-1.0FPC-2H-QFX11P
  rect 0.5x1.5 smd: 1(5,1.3) 2(4,1.3) 3(3,1.3) 4(2,1.3) 5(1,1.3) 6(0,1.3) 7(-1,1.3) 8(-2,1.3) 9(-3,1.3) 10(-4,1.3) 11(-5,1.3)
  rect 2x1.7 smd: 12(-7.2,-1.3) 13(7.2,-1.3)
HDR-TH_3P-P2.54-V-M
  rect 1.7x1.7 hole 1.1: 1(-2.54,0)
  round 1.7 hole 1.1: 2(0,0) 3(2.54,0)
JY901S_无评估板
  rect 1.6x1.6 smd: 1(1.27,-1.27) 2(1.27,-3.81) 3(1.27,-6.35) 4(1.27,-8.89) 5(1.27,-11.43) 6(1.27,-13.97) 7(13.97,-13.97) 8(13.97,-11.43) 9(13.97,-8.89) 10(13.97,-6.35) 11(13.97,-3.81) 12(13.97,-1.27)
LED0805-R-RD
  rect 1x1.399 smd: 1(1.05,0) 2(-1.05,0)
LQFP-100_L14.0-W14.0-P0.50-LS16.0-BL
  oval 0.3x1.6 smd: 1(-6,-7.55) 2(-5.5,-7.55) 3(-5,-7.55) 4(-4.5,-7.55) 5(-4,-7.55) 6(-3.5,-7.55) 7(-3,-7.55) 8(-2.5,-7.55) 9(-2,-7.55) 10(-1.5,-7.55) 11(-1,-7.55) 12(-0.5,-7.55) 13(0,-7.55) 14(0.5,-7.55) 15(1,-7.55) 16(1.5,-7.55) 17(2,-7.55) 18(2.5,-7.55) 19(3,-7.55) 20(3.5,-7.55) 21(4,-7.55) 22(4.5,-7.55) 23(5,-7.55) 24(5.5,-7.55) 25(6,-7.55) 51(6,7.55) 52(5.5,7.55) 53(5,7.55) 54(4.5,7.55) 55(4,7.55) 56(3.5,7.55) 57(3,7.55) 58(2.5,7.55) 59(2,7.55) 60(1.5,7.55) 61(1,7.55) 62(0.5,7.55) 63(0,7.55) 64(-0.5,7.55) 65(-1,7.55) 66(-1.5,7.55) 67(-2,7.55) 68(-2.5,7.55) 69(-3,7.55) 70(-3.5,7.55) 71(-4,7.55) 72(-4.5,7.55) 73(-5,7.55) 74(-5.5,7.55) 75(-6,7.55)
  oval 1.6x0.3 smd: 26(7.55,-6) 27(7.55,-5.5) 28(7.55,-5) 29(7.55,-4.5) 30(7.55,-4) 31(7.55,-3.5) 32(7.55,-3) 33(7.55,-2.5) 34(7.55,-2) 35(7.55,-1.5) 36(7.55,-1) 37(7.55,-0.5) 38(7.55,0) 39(7.55,0.5) 40(7.55,1) 41(7.55,1.5) 42(7.55,2) 43(7.55,2.5) 44(7.55,3) 45(7.55,3.5) 46(7.55,4) 47(7.55,4.5) 48(7.55,5) 49(7.55,5.5) 50(7.55,6) 76(-7.55,6) 77(-7.55,5.5) 78(-7.55,5) 79(-7.55,4.5) 80(-7.55,4) 81(-7.55,3.5) 82(-7.55,3) 83(-7.55,2.5) 84(-7.55,2) 85(-7.55,1.5) 86(-7.55,1) 87(-7.55,0.5) 88(-7.55,0) 89(-7.55,-0.5) 90(-7.55,-1) 91(-7.55,-1.5) 92(-7.55,-2) 93(-7.55,-2.5) 94(-7.55,-3) 95(-7.55,-3.5) 96(-7.55,-4) 97(-7.55,-4.5) 98(-7.55,-5) 99(-7.55,-5.5) 100(-7.55,-6)
MAXON_2
  rect 1.8x1.8 hole 1: 1(0,0)
  round 1.8 hole 1: 2(-2.54,0) 3(-5.08,0) 4(-7.62,0) 5(-10.16,0) 6(-12.7,0) 7(-15.24,0) 8(-17.78,0) 9(-20.32,0) 10(-22.86,0) 11(-25.4,0) 12(-27.94,0) 13(-30.48,0) 14(-25.4,-22.86) 15(-22.86,-22.86) 16(-20.32,-22.86) 17(-17.78,-22.86) 18(-15.24,-22.86) 19(-12.7,-22.86) 20(-10.16,-22.86) 21(-7.62,-22.86) 22(-5.08,-22.86) 23(-2.54,-22.86) 24(0,-22.86)
Pad_ie3645
  custom 4x8 hole 0.254: 0(0,0)
Pad_ie3689
  custom 4x8 hole 0.254: 0(0,0)
Pad_ie3690
  custom 4x8 hole 0.254: 0(0,0)
Pad_ie3691
  custom 4x8 hole 0.254: 0(0,0)
R0603
  rect 0.806x0.864 smd: 1(-0.753,0) 2(0.753,0)
SOIC-8_L5.0-W4.0-P1.27-LS6.0-BL
  oval 0.569x1.95 smd: 1(-1.905,-2.705) 2(-0.635,-2.705) 3(0.635,-2.705) 4(1.905,-2.705) 5(1.905,2.705) 6(0.635,2.705) 7(-0.635,2.705) 8(-1.905,2.705)
SW-SMD_L6.0-W3.3-LS8.0
  rect 1.9x1.5 smd: 1(-4,0) 2(4,0)
SW-TH_SS-12D10L5
  oval 2x3 hole 1.3x2: 1(-4.7,0) 2(0,0) 3(4.7,0)

## Nets
As in the schematic, except:
OSC_IN: C6.1 G2.2 U1.12

Pads without a net: CN3 a1 a2 a7 b1 b2 b7; H6 3; NOREF 0; NOREF#2 0; NOREF#3 0; NOREF#4 0; SW1 3; U1 1 2 3 4 5 6 7 10 11 26 28 29 32 33 34 40 41 42 43 44 45 51 52 54 55 56 57 60 61 62 65 66 69 71 79 80 83 84 85 89 92 93 96 97 98; U3 12 13; U4 12 13; U9 5; U20 12 13; U21 12 13; U25 10 11 12 13 14 21 22 23 24; U26 10 11 12 13 14 21 22 23 24; U27 10 11 12 13 14 21 22 23 24; U28 10 11 12 13 14 21 22 23 24; U29 1 3 4 6 7 12

## Via types
v1: diameter 1, hole 0.5, Top Layer to Bottom Layer, 169 vias
v2: diameter 0.61, hole 0.305, Top Layer to Bottom Layer, 80 vias

## Routing (per net, layer and track width the routed paths; a pad name or vN(x,y) marks a point on that pad's centre or on a via; arc(x,y) is an arc through that point)
3V3: length 442.5
  Top Layer w0.254: v2(55.92,15.52) C11.2 57.77,16.61 C8.2 57.77,16.62 U1.36 U1.37 ; R12.1 82.01,80.27 R14.2 ; v1(53.65,37.01) C9.2 52.77,36.73 U1.100 ; R1.2 v2(44.22,7.21) ; R17.2 40.84,63.43 v2(40.84,61.82) ; R11.1 R18.1 v2(34.48,12.01) ; v2(46.43,19.1) 48.2,19.1 C10.2 49.13,19.11 49.5,19.48 49.5,21.26 49.9,21.65 U1.24 ; R16.2 v2(46.44,61.82) ; U1.75 67.44,33.15 68.37,34.08 C27.2 v2(70.69,34.08) ; v2(66.23,17.88) 66.23,16.67 C12.2 66.13,16.66 64.97,16.66 64.27,17.37 U1.49 64.27,26.85 65.07,27.65 U1.64 69.42,27.65 69.44,27.68
  Top Layer w0.508: C14.2 90.36,7.98 U14.5 ; CN3.a9 CN3.b9 59.77,81.27 60.77,80.27 R15.2 R14.2
  Bottom Layer w0.254: v2(46.44,61.82) v2(40.84,61.82) ; v2(55.92,15.52) 45.24,15.52 43.97,16.79 43.97,19.01 43.88,19.1 ; 44.17,5.89 44.22,5.94 v2(44.22,7.21) ; 32.69,12.02 32.7,12.01 v2(34.48,12.01) ; v2(70.69,34.08) 58.31,34.08 57,32.77 57,26.11 56.21,25.32 54.61,25.32 53.65,26.29 v1(53.65,37.01)
  Bottom Layer w0.508: U14.5 84.47,5.89 35.03,5.89 32.69,8.23 32.69,13.82 31.34,15.16 28.72,15.16 26.29,17.59 26.29,19.09 ; 26.29,19.09 26.29,89.05 27.71,90.47 31.42,90.47 32.94,88.95 34.18,88.95 ; 26.29,19.09 26.3,19.1 v2(46.43,19.1) ; CN3.a9 57.82,90.47 37.44,90.47 35.92,88.95 34.18,88.95 ; 34.18,88.95 34.18,64.5 36.86,61.82 38.29,61.82 ; 38.29,61.82 v2(40.84,61.82) ; 38.29,61.82 38.29,43.6 39.88,42.01 51.16,42.01 53.65,39.52 v1(53.65,37.01) ; v1(90.43,6.42) 90.43,10.65 88.85,12.23 73.93,12.23 72.48,13.68 72.48,16.52 71.12,17.88 v2(66.23,17.88)
  vias: v1(90.43,5.36)
5V: length 141.4
  Top Layer w0.508: 57.23,78.81 57.33,78.71 69.28,78.71 ; 57.23,78.81 57.23,83.88 ; 57.23,78.81 57.23,70.85 50.83,64.44 48.46,64.44 47.47,65.43 U29.11 ; 57.23,83.88 47.45,83.88 ; 57.23,83.88 CN3.b8 CN3.a8 ; 69.28,78.71 C26.1 73.04,63.08 76.84,59.28 76.84,49.86 78.69,48.01 H3.1 ; 69.28,78.71 69.3,78.7 U9.3 ; 47.45,83.88 47.47,83.86 U29.2 ; 47.45,83.88 34.4,83.88 31.83,81.31 H4.1
GND: length 94.1
  Top Layer w0.254: v1(63.17,21.21) 63.77,20.61 U1.48 ; U1.23 48.7,22.15 48.21,21.67 C10.1 ; C13.1 68.49,26.28 67.62,27.15 U1.63 ; C11.1 54.52,17.46 54.94,17.88 56.77,17.88 57.27,18.38 U1.35 57.28,19.61 v1(57.28,21.16) ; U1.74 69.42,32.65 C27.1 ; 53.25,32.94 52.81,32.94 52.04,33.71 v2(49.71,33.71) ; 53.25,32.94 54.74,32.94 55.27,33.48 55.27,34.7 U1.95 ; 53.25,32.94 53.27,32.96 U1.99 ; C9.1 50.97,36.89 v2(49.71,36.89)
  Top Layer w0.381: C6.2 41.08,31.97 41.04,32 41.33,32 ; C7.2 41.05,24.23 v2(40.77,23.95) ; 41.26,37.95 41.31,37.89 C4.2 ; 41.26,37.95 v2(41.82,37.95) v2(42.81,37.95) v2(43.79,37.95) v2(44.78,37.95) v2(45.77,37.95) v2(46.75,37.95) v2(47.74,37.95) v2(48.72,37.95) v2(49.71,37.95) v2(49.71,36.89) v2(49.71,35.83) v2(49.71,34.77) v2(49.71,33.71) v2(49.71,32.66) v2(49.71,31.6) ; 41.26,37.95 v2(40.84,37.95) v2(39.85,37.95) v2(39.85,36.96) v2(39.85,35.97) v2(39.85,34.98) v2(39.85,33.98) v2(39.85,32.99) v2(39.85,32) ; v2(40.76,32) v2(39.85,32) ; v2(39.85,32) v2(39.85,31.01) v2(39.85,30.02) v2(39.85,29.03) v2(39.85,28.04) v2(39.85,27.05) v2(39.85,26.06) v2(39.85,25.07) 39.85,24.87 v2(40.77,23.95) ; v2(40.77,23.95) v2(41.87,23.95) v2(42.97,23.95) v2(44.08,23.95) v2(45.18,23.95) v2(46.28,23.95) 46.43,23.95 48.79,26.31 v2(49.66,26.31) ; 41.33,32 41.31,32.03 C5.2 ; 41.33,32 v2(41.68,32) v2(42.59,32) v2(43.5,32) v2(44.41,32) v2(45.32,32) v2(46.23,32) v2(47.14,32) 47.42,31.72 v2(47.42,31.06) 47.42,30.1 v2(47.57,29.95) 47.57,29.72 v2(48.26,29.03) 48.95,28.35 v2(49.33,28.35)
  Top Layer w0.508: U29.5 39.85,82.56 v1(39.85,82.56) ; v1(39.85,65.08) 39.85,65.08 U29.8
  vias: v1(1.12,75.54) v1(1.12,74.17) v1(1.12,72.8) v1(1.07,41.5) v1(1.07,40.13) v1(1.07,38.76) v1(2.26,97.94) v1(2.26,96.67) v1(2.34,41.5) v1(2.34,40.13) v1(2.34,38.76) v1(2.39,75.54) v1(2.39,74.17) v1(2.39,72.8) v1(3.63,97.94) v1(3.63,96.67) v1(5.01,97.94) v1(5.01,96.67) v1(5.31,11.89) v1(5.31,10.62) v1(6.68,11.89) v1(6.68,10.62) v1(8.05,11.89) v1(8.05,10.62) v1(8.53,33.4) v1(9.91,33.4) v1(11.28,33.4) v1(15.42,79.96) v1(15.85,76.76) v1(18.03,98.09) v1(18.03,96.83) v1(19.41,98.09) v1(19.41,96.83) v1(19.48,14.76) v1(19.48,13.49) v1(20.78,98.09) v1(20.78,96.83) v1(20.85,14.76) v1(20.85,13.49) v1(26.39,105.34) v1(26.39,103.96) v1(26.39,102.59) v1(27.66,105.34) v1(27.66,103.96) v1(27.66,102.59) v1(27.74,58.7) v1(27.74,57.33) v1(27.74,55.95) v1(30.76,85.27) v1(30.78,83.97) v1(33.15,36.37) v1(33.15,35) v1(33.15,33.63) v1(35.03,10.26) v1(35.03,8.99) v1(36.4,10.26) v1(36.4,8.99) v1(36.6,28.73) v1(36.6,27.36) v1(36.6,25.98) v1(36.91,53.88) v1(36.91,52.5) v1(36.91,51.13) v1(37.1,65.08) v1(37.87,28.73) v1(37.87,27.36) v1(37.87,25.98) v1(38.48,65.08) v1(41.22,82.56) v1(42.6,82.56) v1(46.05,20.29) v1(46.86,47.02) v1(46.86,45.64) v1(54.05,76.94) v1(54.05,75.56) v1(54.05,74.19) v1(58.39,15.37) v1(58.9,38.79) v1(60.43,75.44) v1(60.43,74.17) v1(61.8,75.44) v1(61.8,74.17) v1(62.28,29.16) v1(63.17,75.44) v1(63.17,74.17) v1(63.65,29.16) v1(67.61,38.23) v1(68.07,73.79) v1(68.07,72.42) v1(68.07,71.04) v1(68.73,44.96) v1(68.73,43.69) v1(68.99,38.23) v1(69.34,73.79) v1(69.34,72.42) v1(69.34,71.04) v1(70.1,44.96) v1(70.1,43.69) v1(70.36,38.23) v1(70.71,32.56) v1(71.15,16.18) v1(71.4,26.92) v1(71.48,44.96) v1(71.48,43.69) v1(72.77,26.92) v1(75.01,71.02) v1(75.01,69.65) v1(75.01,68.27) v1(78,76.38) v1(78,75.11) v1(78.46,56.11) v1(78.46,54.74) v1(78.46,53.36) v1(79.38,76.38) v1(79.38,75.11) v1(79.73,56.11) v1(79.73,54.74) v1(79.73,53.36) v1(80.06,24.56) v1(80.06,23.19) v1(80.06,21.82) v1(81.33,24.56) v1(81.33,23.19) v1(81.33,21.82) v1(89.56,50.45) v1(89.56,49.07) v1(89.56,47.7) v1(95.02,15.06) v1(95.02,13.79) v1(95.45,102.44) v1(95.45,101.07) v1(95.45,99.69) v1(95.91,7.19) v1(95.91,5.92) v1(96.39,15.06) v1(96.39,13.79) v1(96.65,45.54) v1(96.65,44.27) v1(96.72,102.44) v1(96.72,101.07) v1(96.72,99.69) v1(96.7,53.52) v1(96.7,52.25) v1(97.28,7.19) v1(97.28,5.92) v1(98.02,45.54) v1(98.02,44.27) v1(98.07,53.52) v1(98.07,52.25) v1(100.71,91.5) v1(102.08,91.5) v1(103.45,91.5) v1(103.73,72.59) v1(105.1,72.59) v1(106.32,16.64) v1(106.48,72.59) v1(107.44,16.1) v1(107.47,53.62) v1(107.47,52.35) v1(108.84,53.62) v1(108.84,52.35) v1(109.73,72.62) v2(47.19,24.66) v2(47.9,25.45) v2(48.69,26.16)
VBUS: length 86.8
  Top Layer w2.54: SW1.1 29.97,12.65 18.42,24.21 18.42,90.63
VCC: length 249.1
  Top Layer w2.032: U28.4 106.78,63.65 102.74,59.61 102.74,25.04 ; 102.74,25.04 102.74,15.72 97.92,10.9 42.6,10.9 36.02,4.32 19.89,4.32 13.69,10.52 13.69,77.19 9.95,80.93 U25.4 ; 102.74,25.04 111.92,25.04 U26.4 ; 13.49,42.34 13.46,42.31 U27.4
  Top Layer w2.54: 25.25,4.93 25.27,4.95 SW1.2
VCC5V_IN1: length 36.2
  Bottom Layer w0.508: U20.11 17.06,91.57 3.76,91.57 1.9,89.71 1.9,79.1 U25.6
VCC5V_IN2: length 68.6
  Bottom Layer w0.508: U21.11 93.8,22.83 93.8,46.79 96.32,49.3 112.67,49.3 114.58,47.4 114.58,32.75 U26.6
VCC5V_IN3: length 22.8
  Bottom Layer w0.508: U3.11 101.14,78.63 101.14,70.74 103.15,68.73 U28.6
VCC5V_IN4: length 20.6
  Bottom Layer w0.508: U4.11 16.51,30.27 16.51,34.09 13.36,37.23 U27.6
ADC1: length 75.6
  Top Layer w0.254: v2(53.29,24.64) 52.3,23.65 U1.20
  Bottom Layer w0.254: v2(53.29,24.64) 51.05,26.87 51.05,37.77 49.73,39.09 36.98,39.09 35.56,40.51 35.56,61.42 33.91,63.07 31.5,63.07 30.05,64.52 30.05,76.36 U25.20
ADC2: length 77.6
  Top Layer w0.254: U1.21 52.72,23.15 v2(53.34,23.77)
  Bottom Layer w0.254: U25.19 29.39,74.48 29.39,64.11 31.11,62.38 33.53,62.38 34.8,61.11 34.8,24.56 36.58,22.78 52.35,22.78 v2(53.34,23.77)
ADC3: length 41.3
  Top Layer w0.254: U1.22 v2(53.44,22.65)
  Bottom Layer w0.254: 89.07,27.62 76.51,27.62 75.67,26.77 75.67,24.41 73.91,22.65 v2(53.44,22.65)
ADC4: length 45
  Top Layer w0.254: v2(54.15,23.44) 54.15,21.67 53.64,21.15 U1.25
  Bottom Layer w0.254: v2(54.15,23.44) 73.46,23.44 74.9,24.89 74.9,29.03 75.98,30.11 U26.19
ADC5: length 80.1
  Top Layer w0.254: U1.53 74.34,22.15 75.51,20.98 75.51,17.37 77.19,15.7 89.76,15.7 91.13,17.07 91.13,64.12 U28.20
ADC6: length 75.9
  Top Layer w0.254: v2(55.02,27.66) 53.51,26.15 U1.15
  Bottom Layer w0.254: v2(55.02,27.66) 55.02,35.15 56.31,36.45 72.52,36.45 74.4,38.33 81.36,38.33 82.68,39.65 82.68,66.95 84.45,68.73 U28.19
ADC7: length 38.3
  Top Layer w0.254: U27.20 31.57,36.21 31.57,24.36 33.02,22.91 46.33,22.91 49.07,25.65 U1.16
ADC8: length 36.7
  Top Layer w0.254: U27.19 30.78,34.46 30.78,23.93 32.39,22.33 46.48,22.33 49.31,25.15 U1.17
CAN_H_BUS: length 6.6
  Top Layer w0.254: U9.7 68.03,85.35 CN3.b12 CN3.a12
CAN_L_BUS: length 6.6
  Top Layer w0.254: CN3.a13 CN3.b13 69.3,85.35 U9.6
CAN_RX: length 56.3
  Top Layer w0.254: U9.4 70.57,63.24 75.46,58.34 75.46,32.44 74.22,31.19 68.4,31.19 67.94,31.65 U1.72
CAN_TX: length 56
  Top Layer w0.254: U1.73 68.2,32.15 68.61,31.75 73.38,31.75 74.57,32.94 74.57,57.73 66.76,65.55 U9.1
CC2530_RX1: length 59.9
  Top Layer w0.254: v2(55.6,26.92) 54.77,26.09 U1.30
  Bottom Layer w0.254: H3.3 83.49,51.03 83.49,39.24 81.91,37.67 74.68,37.67 72.87,35.86 56.79,35.86 55.6,34.67 v2(55.6,26.92)
CC2530_RX2: length 44.8
  Top Layer w0.254: U1.87 59.27,36.95 55.14,41.07 35.28,41.07 34.09,42.27 v2(34.09,55.19)
  Bottom Layer w0.254: H4.3 31.84,55.19 v2(34.09,55.19)
CC2530_TX1: length 57.1
  Top Layer w0.254: v2(56.21,26.26) 55.27,25.32 U1.31
  Bottom Layer w0.254: H3.2 84.15,49.15 84.15,38.73 82.35,36.93 74.88,36.93 73.2,35.25 57.43,35.25 56.21,34.04 v2(56.21,26.26)
CC2530_TX2: length 46.1
  Top Layer w0.254: U1.88 58.77,36.41 54.81,40.36 34.85,40.36 33.38,41.83 33.38,56.46 32.09,57.75 H4.2
DIC1_B: length 56.6
  Top Layer w0.254: U1.91 57.27,36.08 54.61,38.73 31.67,38.73 29.62,40.79 29.62,64.16 28.08,65.69 U25.15
DIC1_F: length 59.2
  Top Layer w0.254: U25.16 30.4,65.84 30.4,41.07 31.98,39.5 54.74,39.5 57.77,36.47 U1.90
DIC2_B: length 37.5
  Top Layer w0.254: U26.15 90.35,38.99 90.35,37.24 89.56,36.45 79.81,36.45 78.26,34.9 78.26,26.92 75.99,24.65 U1.58
DIC2_F: length 33.1
  Top Layer w0.254: U1.59 75.39,25.15 77.37,27.13 77.37,35.94 79.15,37.73 U26.16
DIC3_B: length 68.5
  Top Layer w0.254: U1.82 61.77,38.82 v2(61.75,38.84)
  Bottom Layer w0.254: U28.15 82.52,78.89 80.97,77.34 80.97,42.49 78.79,40.31 63.22,40.31 v2(61.75,38.84)
DIC3_F: length 64.9
  Top Layer w0.254: v2(62.76,38.02) 62.27,37.53 U1.81
  Bottom Layer w0.254: U28.16 83.26,76.35 81.89,74.98 81.89,42.29 79.32,39.73 64.47,39.73 v2(62.76,38.02)
DIC4_B: length 28.8
  Top Layer w0.254: U1.19 49.76,24.15 46.79,21.18 30.56,21.18 29.36,22.38 29.36,25.72 U27.15
DIC4_F: length 30.2
  Top Layer w0.254: U1.18 49.52,24.65 46.63,21.77 31.52,21.77 30.07,23.22 30.07,27.51 28.01,29.57 U27.16
E7: length 28.7
  Top Layer w0.254: LED1.2 41.93,16.52 43.87,14.58 60.68,14.58 61.52,15.42 61.52,17.04 60.92,17.65 59.52,17.65 58.77,18.4 U1.38
E8: length 28.8
  Top Layer w0.254: LED3.2 60.77,13.98 62,15.21 62,17.27 61.19,18.09 59.77,18.09 59.27,18.59 U1.39
HALL1_1: length 36.9
  Bottom Layer w0.254: U20.9 15.7,90.09 4.14,90.09 3.15,89.1 3.15,80.83 4.35,79.63 6,79.63 6.83,78.8 6.83,74.99 U25.7
HALL1_2: length 30.8
  Bottom Layer w0.254: U20.8 21.56,82.82 21.56,74.09 18.25,70.77 U25.8
HALL1_3: length 34.6
  Bottom Layer w0.254: U25.9 17.43,68.23 22.61,73.41 22.61,84.61 U20.10
HALL2_1: length 36.1
  Bottom Layer w0.254: U26.7 113.51,34.23 113.51,35.69 112.72,36.47 98.07,36.47 95.73,34.14 95.73,23.73 U21.9
HALL2_2: length 28
  Bottom Layer w0.254: U26.8 98.2,35.19 96.6,33.58 96.6,24.28 U21.8
HALL2_3: length 33
  Bottom Layer w0.254: U21.10 94.89,23.15 94.89,34.8 97.82,37.73 U26.9
HALL3_1: length 21.5
  Bottom Layer w0.254: U3.9 103.65,83.97 106.27,83.97 107.95,82.3 107.95,72.62 109.3,71.27 U28.7
HALL3_2: length 20.3
  Bottom Layer w0.254: U28.8 109.86,73.81 108.59,75.08 108.59,82.73 106.6,84.71 102.98,84.71 101.34,83.07
HALL3_3: length 36.6
  Bottom Layer w0.254: U3.10 100.05,78.95 100.05,69.75 102.41,67.39 112.57,67.39 113.59,68.4 113.59,74.69 U28.9
HALL4_1: length 19.9
  Bottom Layer w0.254: U27.7 7.24,32.6 7.24,25.15 8.92,23.47 12.54,23.47 14.99,25.91
HALL4_2: length 19
  Bottom Layer w0.254: U27.8 6.55,30.75 6.55,24.69 8.48,22.76 13.25,22.76 U4.8
HALL4_3: length 34.5
  Bottom Layer w0.254: U4.10 17.53,29.87 17.53,34.59 13.56,38.56 4.22,38.56 3.11,37.45 3.11,31.65 U27.9
I2C1_SCL: length 51.4
  Top Layer w0.254: U1.78 63.77,38.27 62.28,39.75 57.43,39.75 55.42,41.76 43.56,41.76 42.39,42.93 R17.1 U29.9
I2C1_SDA: length 40.7
  Top Layer w0.254: U29.10 R16.1 v2(44.93,43.69) ; v2(54.61,37.74) 55.77,36.59 U1.94
  Bottom Layer w0.254: v2(54.61,37.74) 54.61,39.91 50.83,43.69 v2(44.93,43.69)
I2C_SCL_BUS: length 118.8
  Top Layer w0.254: v2(68.81,28.73) 68.38,29.15 U1.67 ; R15.1 62.31,85.98 CN3.b10 CN3.a10
  Bottom Layer w0.254: v2(68.81,28.73) 71.63,28.73 74.29,31.39 90.12,31.39 91.75,33.02 91.75,85.32 89.26,87.81 80.95,87.81 78.26,90.5 64.29,90.5 CN3.a10
I2C_SDA_BUS: length 112.3
  Top Layer w0.254: R14.1 64.85,82.04 CN3.b11 CN3.a11 ; U1.68 v2(69.14,29.65)
  Bottom Layer w0.254: CN3.a11 66.17,89.84 77.88,89.84 80.57,87.15 88.77,87.15 90.86,85.06 90.86,34.9 89.87,33.91 75.16,33.91 70.9,29.65 v2(69.14,29.65)
NRST: length 305
  Top Layer w0.254: U1.14 52.76,26.65 v2(54.36,28.25) ; CN3.a14 73.72,87.27 109.91,87.27 110.79,88.16 112.85,88.16 114.35,86.67 114.35,13 111.46,10.11 103.61,10.11 97.36,3.86 54.49,3.86 52.95,2.32 KEY1.2 C3.2 46.9,5.38 R1.1 51.05,7.21 51.82,7.98 U14.1
  Bottom Layer w0.254: CN3.a14 73.71,87.29 73.71,43.08 72.24,41.61 61.34,41.61 60.3,40.56 60.3,37.74 59.61,37.06 55.91,37.06 54.36,35.51 v2(54.36,28.25)
OSC32_IN: length 14
  Top Layer w0.254: C4.1 44.83,36.6 G1.2 44.88,36.55 47.42,36.55 48.97,35 48.97,30.53 49.85,29.65 U1.8
OSC32_OUT: length 12
  Top Layer w0.254: U1.9 49.49,29.15 48.29,30.35 48.29,32.79 47.02,34.06 G1.1 44.85,34.04 C5.1
OSC_IN: length 11.4
  Top Layer w0.254: C6.1 41.97,28.36 43.12,29.51 G2.2 46.77,29.51 48.62,27.65 U1.12
OSC_OUT: length 11.4
  Top Layer w0.254: U1.13 48.59,27.15 46.84,25.41 G2.1 43.07,25.41 41.95,26.53 C7.1
PWM1: length 83.6
  Top Layer w0.254: U1.27 53.27,16.31 52.32,15.37 44.32,15.37 41.48,18.21 28.78,18.21 26.34,20.65 26.34,69.1 U25.17
PWM2: length 31.4
  Top Layer w0.254: U1.86 v2(59.77,33.38)
  Bottom Layer w0.254: v2(59.77,33.38) 73.18,33.38 74.99,35.19 U26.17
PWM3: length 62.3
  Top Layer w0.254: U1.70 75.36,30.65 76.38,31.67 76.38,36.8 78.38,38.81 85.98,38.81 87.71,40.54 87.71,72.44 U28.17
PWM4: length 47.1
  Top Layer w0.254: U1.50 64.77,20.82 v2(65.02,21.08)
  Bottom Layer w0.254: v2(65.02,21.08) 64.04,22.07 36.28,22.07 34.14,24.21 34.14,30.86 32.85,32.15 U27.17
R1_1: length 10.7
  Bottom Layer w1.016: U25.1 6.31,88.55 13.08,81.79
R1_2: length 27.6
  Bottom Layer w1.016: 15.67,82.23 18.19,79.72 18.19,76.81 16.03,74.65 12.23,74.65 9.83,77.05 9.83,81.34 U25.2
R1_3: length 31.8
  Bottom Layer w1.016: 16.97,83.62 19.98,80.61 19.98,75.7 17.38,73.1 11.28,73.1 8.13,76.25 8.13,80.5 U25.3
R2_1: length 14.6
  Bottom Layer w1.016: U26.1 108.6,17.41 106.6,19.41 106.6,23.55 103.56,26.59
R2_2: length 26.8
  Bottom Layer w1.016: 102.31,25.2 104.32,23.19 104.32,15.8 105.66,14.45 112.78,14.45 114.35,16.03 114.35,18.26 112.67,19.95 U26.2
R2_3: length 34.6
  Bottom Layer w1.016: U26.3 112.52,22.49 115.98,19.02 115.98,14.71 114.05,12.78 104.5,12.78 102.49,14.78 102.49,21.84 100.66,23.67
R3_1: length 48.6
  Bottom Layer w1.016: U28.1 97.54,56.03 93.29,60.27 93.29,84.1 96.37,87.17
R3_2: length 43
  Bottom Layer w1.016: U28.2 98.71,58.57 95.28,62 95.28,83.46 97.71,85.9
R3_3: length 37.3
  Bottom Layer w1.016: U28.3 99.65,61.11 97.26,63.5 97.26,82.58 99.09,84.4
R4_1: length 43.5
  Bottom Layer w1.016: U27.1 15.68,49.93 23.09,42.52 23.09,23.77 20.45,21.13
R4_2: length 38.7
  Bottom Layer w1.016: U27.2 15.32,47.39 21.13,41.58 21.13,24.99 U4.4
R4_3: length 33.8
  Bottom Layer w1.016: U27.3 15.45,44.85 19.41,40.89 19.41,25.73 17.47,23.8
SWCLK: length 119.1
  Top Layer w0.254: v2(59.74,21.11) 59.74,30.18 61.21,31.65 63.32,31.65 64.27,32.59 U1.77 64.27,36.86 v2(64.64,37.24)
  Bottom Layer w0.254: U14.2 77.72,9.32 61.39,9.32 59.74,10.97 v2(59.74,21.11) ; CN3.a15 76.28,87.26 76.28,42.75 74.47,40.94 61.7,40.94 60.88,40.13 60.88,37.95 61.59,37.24 v2(64.64,37.24)
SWDIO: length 92.1
  Top Layer w0.254: v2(60.78,21.13) 60.78,30.2 61.65,31.06 63.58,31.06 64.77,32.25 U1.76
  Bottom Layer w0.254: 84.06,10.11 61.93,10.11 60.78,11.25 v2(60.78,21.13) ; 84.06,10.11 U14.4 ; 84.06,10.11 87.66,10.11 88.77,8.99 88.77,6.02 87.45,4.7 60.85,4.7 H6.2
SWDIO_BUS: length 182.5
  Top Layer w0.254: CN3.a16 77.67,88.64 77.67,91.67 79.17,93.17 113.51,93.17 115.72,90.96 115.72,12.7 111.91,8.89 104.17,8.89 97.62,2.35 H6.1
  Bottom Layer w0.254: CN3.a16 CN3.b16
UART_RX_BUS: length 120.2
  Top Layer w0.254: U1.47 63.27,16.44 64.69,15.01 90.3,15.01 92.18,16.89 92.18,82.45 90.83,83.79 74.66,83.79 CN3.b14
UART_TX_BUS: length 121.1
  Top Layer w0.254: U1.46 62.77,16.2 64.49,14.48 90.91,14.48 93.22,16.79 93.22,82.86 91.49,84.58 76.41,84.58 CN3.b15
$1N3007: length 2.5
  Top Layer w0.254: 83.55,80.14 83.55,82.63
$1N3059: length 2
  Top Layer w0.254: LED1.1 36,16.52 35.98,16.53
$1N7223: length 2
  Top Layer w0.254: LED3.1 37.95,13.99 35.98,13.99

## Copper pours and planes (outline as drawn; the poured copper is in the pictures)
3V3 on Top Layer: 89.61,8.76 91.24,8.76 91.24,4.71 89.61,4.71
3V3 on Bottom Layer: 89.48,7.09 91.43,7.09 91.43,4.5 89.48,4.5
GND on Top Layer: -36.3,125.02 142.6,125.02 142.6,-29.49 -36.3,-29.49
GND on Bottom Layer: -35.23,131.39 137.57,131.39 137.57,-31.06 -35.23,-31.06
VBUS on Top Layer: 13.18,93.47 53.31,93.47 53.31,84.96 13.18,84.96
R1_1 on Bottom Layer: 12.47,82.4 14.73,82.4 14.73,80.14 12.47,80.14
R1_2 on Bottom Layer: 13.9,83.82 16.16,83.82 16.16,81.56 13.9,81.56
R1_3 on Bottom Layer: 15.33,85.2 17.59,85.2 17.59,82.94 15.33,82.94
R2_1 on Bottom Layer: 102.04,28.13 104.31,28.13 104.31,25.87 102.04,25.87
R2_2 on Bottom Layer: 100.57,26.74 102.83,26.74 102.83,24.47 100.57,24.47
R2_3 on Bottom Layer: 99.12,25.26 101.38,25.26 101.38,23 99.12,23
R3_1 on Bottom Layer: 95.59,88.81 97.85,88.81 97.85,86.55 95.59,86.55
R3_2 on Bottom Layer: 96.99,87.37 99.25,87.37 99.25,85.11 96.99,85.11
R3_3 on Bottom Layer: 98.44,85.97 100.7,85.97 100.7,83.71 98.44,83.71
R4_1 on Bottom Layer: 18.86,21.75 21.12,21.75 21.12,19.49 18.86,19.49
R4_2 on Bottom Layer: 17.46,23.18 19.72,23.18 19.72,20.92 17.46,20.92
R4_3 on Bottom Layer: 16.01,24.6 18.28,24.6 18.28,22.34 16.01,22.34

Small or netless copper shapes (teardrops, artwork), in the pictures only: 267 on Top Layer, 100 on Bottom Layer

## Text on the board
Bottom Silkscreen Layer: UART2 | UART1
Top Silkscreen Layer: 复位 | 烧录跳线 | 板载烧录 | NRST | SWCLK | GND | SWDIO | 3.3V | OFF | 电机开关 | ON | E7 | E8 | 0 | 1 | POWER
